# EAGLE schematic Accumulator Control Unit rev3 (EAGLE 9.6.2)

## Sheet 1 of 6: Connectors, Power Fusing, TSAL
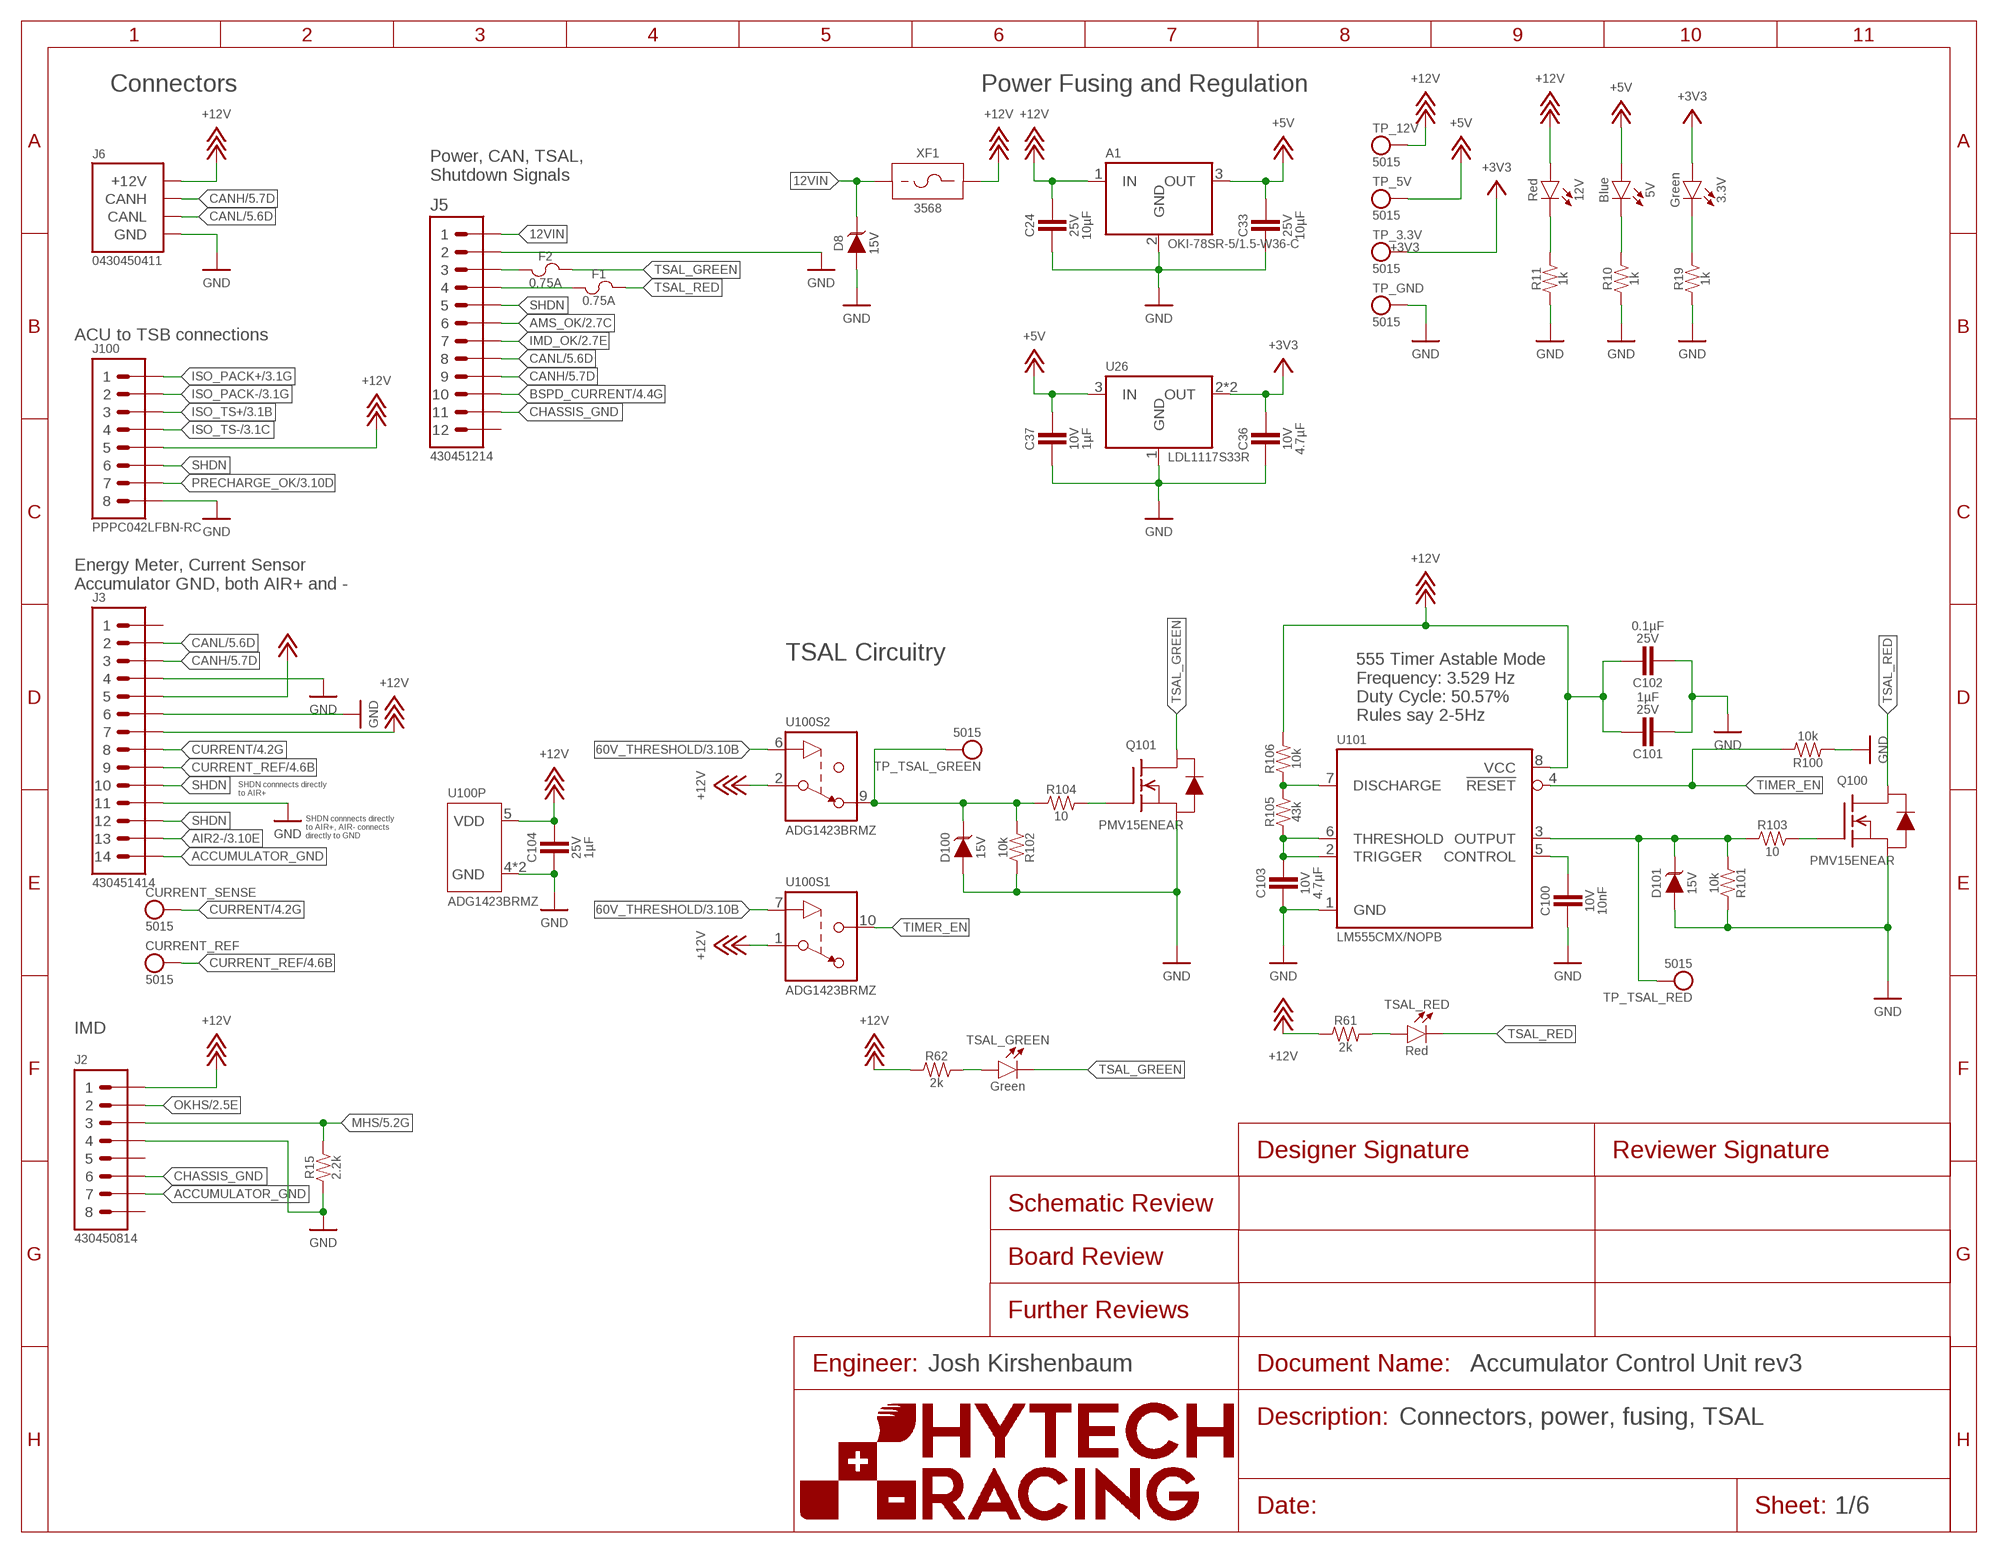
[diagram p0: schematic, sheet 1]
FRAME1 (FRAME): DESCRIPTION_1: Connectors, power, fusing, TSAL

### Parts
3.3V  LED_0603_GREEN  [0603-LED]
5V  LED_0603_BLUE  [0603-LED]
12V  LED_0603_RED  [0603-LED]
A1  VOLTAGE_REGULATOR_MODULE_OKI-78SR_5V  [OKI-78SR]
C24  CAPACITOR_0603_25V_10UF  [0603-CAP]
C33  CAPACITOR_0603_25V_10UF  [0603-CAP]
C36  CAPACITOR_0603_10V_4.7UF  [0603-CAP]
C37  CAPACITOR_0603_10V_1UF  [0603-CAP]
C100  CAPACITOR_0603_10V_10NF  [0603-CAP]
C101  CAPACITOR_0603_25V_1UF  [0603-CAP]
C102  CAPACITOR_0603_25V_0.1UF  [0603-CAP]
C103  CAPACITOR_0603_10V_4.7UF  [0603-CAP]
C104  CAPACITOR_0603_25V_1UF  [0603-CAP]
CURRENT_REF  TEST_POINT  [MICRO_MINIATURE]
CURRENT_SENSE  TEST_POINT  [MICRO_MINIATURE]
D8  TVS_15V  [SOT-23]
D100  TVS_15V  [SOT-23]
D101  TVS_15V  [SOT-23]
F1  FUSE_0603_.75A  [0603-FUSE]
F2  FUSE_0603_.75A  [0603-FUSE]
J2  CONNECTOR-8_MF_T_V_  [MOLEX_MICROFIT_PTH_VERTICAL_08_DUAL]
J3  CONNECTOR-14_MF_T_V_  [MOLEX_MICROFIT_PTH_VERTICAL_14_DUAL]
J5  CONNECTOR-12_MF_T_V_  [MOLEX_MICROFIT_PTH_VERTICAL_12_DUAL]
J6  CONNECTOR-CAN_μF_S_RA_  [MOLEX_MICROFIT_SMD_RIGHTANGLE_04_DUAL]
J100  CONNECTOR-8_S_S  [FLEX_STACK_PTH_08_DUAL]
Q100  TRANSISTOR_N_MOS__PMV15ENEA  [SOT-23]
Q101  TRANSISTOR_N_MOS__PMV15ENEA  [SOT-23]
R10  RESISTOR_0603_1K  [0603-RES]
R11  RESISTOR_0603_1K  [0603-RES]
R15  RESISTOR_0603_2.2K  [0603-RES]
R19  RESISTOR_0603_1K  [0603-RES]
R61  RESISTOR_0603_2K  [0603-RES]
R62  RESISTOR_0603_2K  [0603-RES]
R100  RESISTOR_0603_10K  [0603-RES]
R101  RESISTOR_0603_10K  [0603-RES]
R102  RESISTOR_0603_10K  [0603-RES]
R103  RESISTOR_0603_10  [0603-RES]
R104  RESISTOR_0603_10  [0603-RES]
R105  RESISTOR_0603_43K  [0603-RES]
R106  RESISTOR_0603_10K  [0603-RES]
TP_3.3V  TEST_POINT  [MICRO_MINIATURE]
TP_5V  TEST_POINT  [MICRO_MINIATURE]
TP_12V  TEST_POINT  [MICRO_MINIATURE]
TP_GND  TEST_POINT  [MICRO_MINIATURE]
TP_TSAL_GREEN  TEST_POINT  [MICRO_MINIATURE]
TP_TSAL_RED  TEST_POINT  [MICRO_MINIATURE]
TSAL_GREEN  LED_0603_GREEN  [0603-LED]
TSAL_RED  LED_0603_RED  [0603-LED]
U26  VOLTAGE_REGULATOR_SOT223_3.3V  [SOT223]
U100  ADG1423  [MSOP-10]
U101  LM555  [SOIC-08(NARROW,0.15")]
XF1  FUSE_HOLDER_MINIBLADEPTH  [3568]

### Nets
12VIN: D8.3(C) J5.1 XF1.1 XF1.2
60V_THRESHOLD: U100.6(S2:IN) U100.7(S1:IN) ; also sheet 3
+3V3: 3.3V.2(A) C36.1 TP_3.3V.1 U26.2(OUT) U26.4(OUT) ; also sheet 4,5
+5V: 5V.2(A) A1.3(OUT) C33.1 C37.1 J3.5 TP_5V.1 U26.3(IN) ; also sheet 3,5
+12V: 12V.2(A) A1.1(IN) C24.1 C101.1 C102.1 C104.1 J2.1 J3.7 J6.1(+12V) J100.5 R61.1 R62.1 R106.2 TP_12V.1 U100.1(S1:S) U100.2(S2:S) U100.5(P:VDD) U101.8(VCC) XF1.3 XF1.4 ; also sheet 2,4,5
ACCUMULATOR_GND: J2.7 J3.14
AIR2-: J3.13 ; also sheet 3
AMS_OK: J5.6 ; also sheet 2
BSPD_CURRENT: J5.10 ; also sheet 4,5
CANH: J3.3 J5.9 J6.4(CANH) ; also sheet 5
CANL: J3.2 J5.8 J6.3(CANL) ; also sheet 5
CHASSIS_GND: J2.6 J5.11
CURRENT: CURRENT_SENSE.1 J3.8 ; also sheet 4
CURRENT_REF: CURRENT_REF.1 J3.9 ; also sheet 4
GND: A1.2(GND) C24.2 C33.2 C36.2 C37.2 C100.2 C101.2 C102.2 C103.2 C104.2 D8.1(A) D100.1(A) D101.1(A) J2.4 J3.4 J3.6 J3.11 J5.2 J6.2(GND) J100.8 Q100.2(S) Q101.2(S) R10.1 R11.1 R15.1 R19.1 R100.1 R101.2 R102.2 TP_GND.1 U26.1(GND) U100.4(P:GND) U100.8(P:GND) U101.1(GND) ; also sheet 2,3,4,5
IMD_OK: J5.7 ; also sheet 2,5
ISO_PACK+: J100.1 ; also sheet 3
ISO_PACK-: J100.2 ; also sheet 3
ISO_TS+: J100.3 ; also sheet 3
ISO_TS-: J100.4 ; also sheet 3
MHS: J2.3 R15.2 ; also sheet 5
N$1: 3.3V.1(C) R19.2
N$2: 5V.1(C) R10.2
N$3: C103.1 R105.1 U101.2(TRIGGER) U101.6(THRESHOLD)
N$5: C100.1 U101.5(CONTROL)
N$6: R105.2 R106.1 U101.7(DISCHARGE)
N$14: 12V.1(C) R11.2
N$18: D100.3(C) R102.1 R104.1 TP_TSAL_GREEN.1 U100.9(S2:D)
N$19: D101.3(C) R101.1 R103.1 TP_TSAL_RED.1 U101.3(OUTPUT)
N$24: R62.2 TSAL_GREEN.2(A)
N$28: F2.1 J5.3
N$31: F1.1 J5.4
N$46: R61.2 TSAL_RED.2(A)
N$60: Q100.1(G) R103.2
N$61: Q101.1(G) R104.2
OKHS: J2.2 ; also sheet 2
PRECHARGE_OK: J100.7 ; also sheet 3,5
SHDN: J3.10 J3.12 J5.5 J100.6
TIMER_EN: R100.2 U100.10(S1:D) U101.4(!RESET)
TSAL_GREEN: F2.2 Q101.3(D) TSAL_GREEN.1(C)
TSAL_RED: F1.2 Q100.3(D) TSAL_RED.1(C)
Unconnected: J2.5 J2.8 J3.1 J5.12

### Notes on the sheet
- Connectors | Power Fusing and Regulation
- Power, CAN, TSAL, 
  Shutdown Signals
- ACU to TSB connections
- Energy Meter, Current Sensor
  Accumulator GND, both AIR+ and -
- TSAL Circuitry
- 555 Timer Astable Mode
  Frequency: 3.529 Hz
  Duty Cycle: 50.57%
  Rules say 2-5Hz
- SHDN connnects directly
  to AIR+
- SHDN connnects directly
  to AIR+, AIR- connects
  directly to GND
- IMD
- Josh Kirshenbaum

## Sheet 2 of 6: Shutdown Circuitry
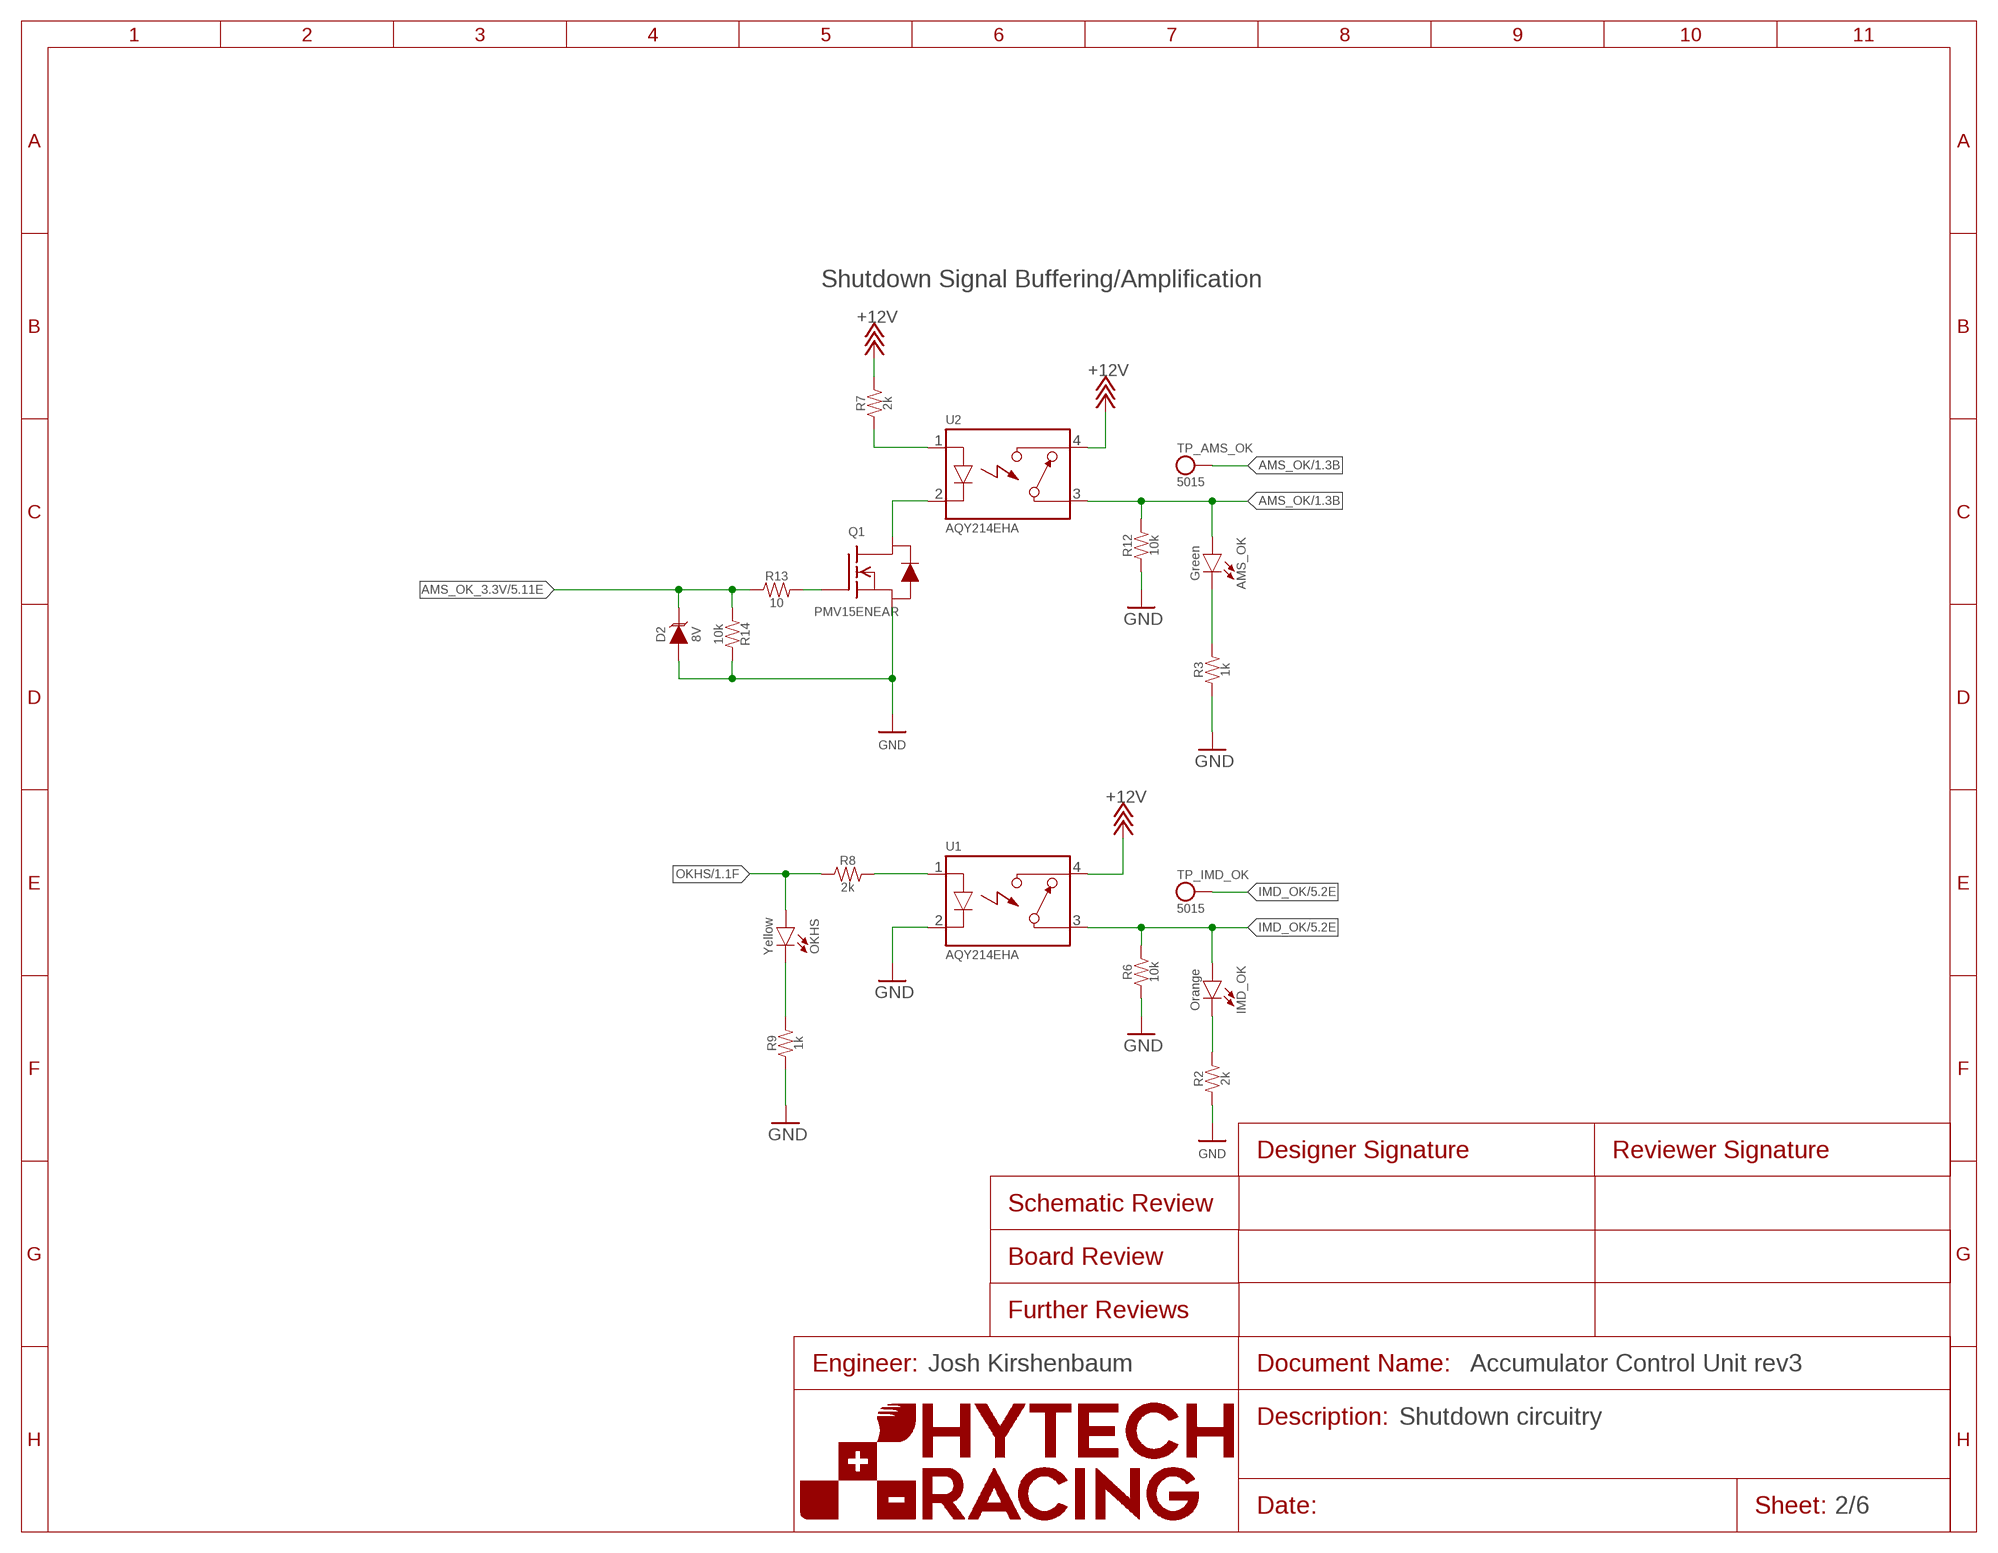
[diagram p1: schematic, sheet 2]
FRAME2 (FRAME): DESCRIPTION_1: Shutdown circuitry

### Parts
AMS_OK  LED_0603_GREEN  [0603-LED]
D2  TVS_8V  [SOT-23]
IMD_OK  LED_0603_ORANGE  [0603-LED]
OKHS  LED_0603_YELLOW  [0603-LED]
Q1  TRANSISTOR_N_MOS__PMV15ENEA  [SOT-23]
R2  RESISTOR_0603_2K  [0603-RES]
R3  RESISTOR_0603_1K  [0603-RES]
R6  RESISTOR_0603_10K  [0603-RES]
R7  RESISTOR_0603_2K  [0603-RES]
R8  RESISTOR_0603_2K  [0603-RES]
R9  RESISTOR_0603_1K  [0603-RES]
R12  RESISTOR_0603_10K  [0603-RES]
R13  RESISTOR_0603_10  [0603-RES]
R14  RESISTOR_0603_10K  [0603-RES]
TP_AMS_OK  TEST_POINT  [MICRO_MINIATURE]
TP_IMD_OK  TEST_POINT  [MICRO_MINIATURE]
U1  RELAY_SOLIDSTATE_NO  [DIP-4]
U2  RELAY_SOLIDSTATE_NO  [DIP-4]

### Nets
+12V: R7.2 U1.4(CONTACT2) U2.4(CONTACT2) ; also sheet 1,4,5
AMS_OK: AMS_OK.2(A) R12.2 TP_AMS_OK.1 U2.3(CONTACT1) ; also sheet 1
AMS_OK_3.3V: D2.3(C) R13.1 R14.1 ; also sheet 5
GND: D2.1(A) Q1.2(S) R2.1 R3.1 R6.1 R9.1 R12.1 R14.2 U1.2(CONTROL-) ; also sheet 1,3,4,5
IMD_OK: IMD_OK.2(A) R6.2 TP_IMD_OK.1 U1.3(CONTACT1) ; also sheet 1,5
N$8: R8.2 U1.1(CONTROL+)
N$9: OKHS.1(C) R9.2
N$16: R7.1 U2.1(CONTROL+)
N$17: AMS_OK.1(C) R3.2
N$20: Q1.3(D) U2.2(CONTROL-)
N$27: IMD_OK.1(C) R2.2
N$30: Q1.1(G) R13.2
OKHS: OKHS.2(A) R8.1 ; also sheet 1

### Notes on the sheet
- Shutdown Signal Buffering/Amplification
- Josh Kirshenbaum

## Sheet 3 of 6: Precharge Circuit
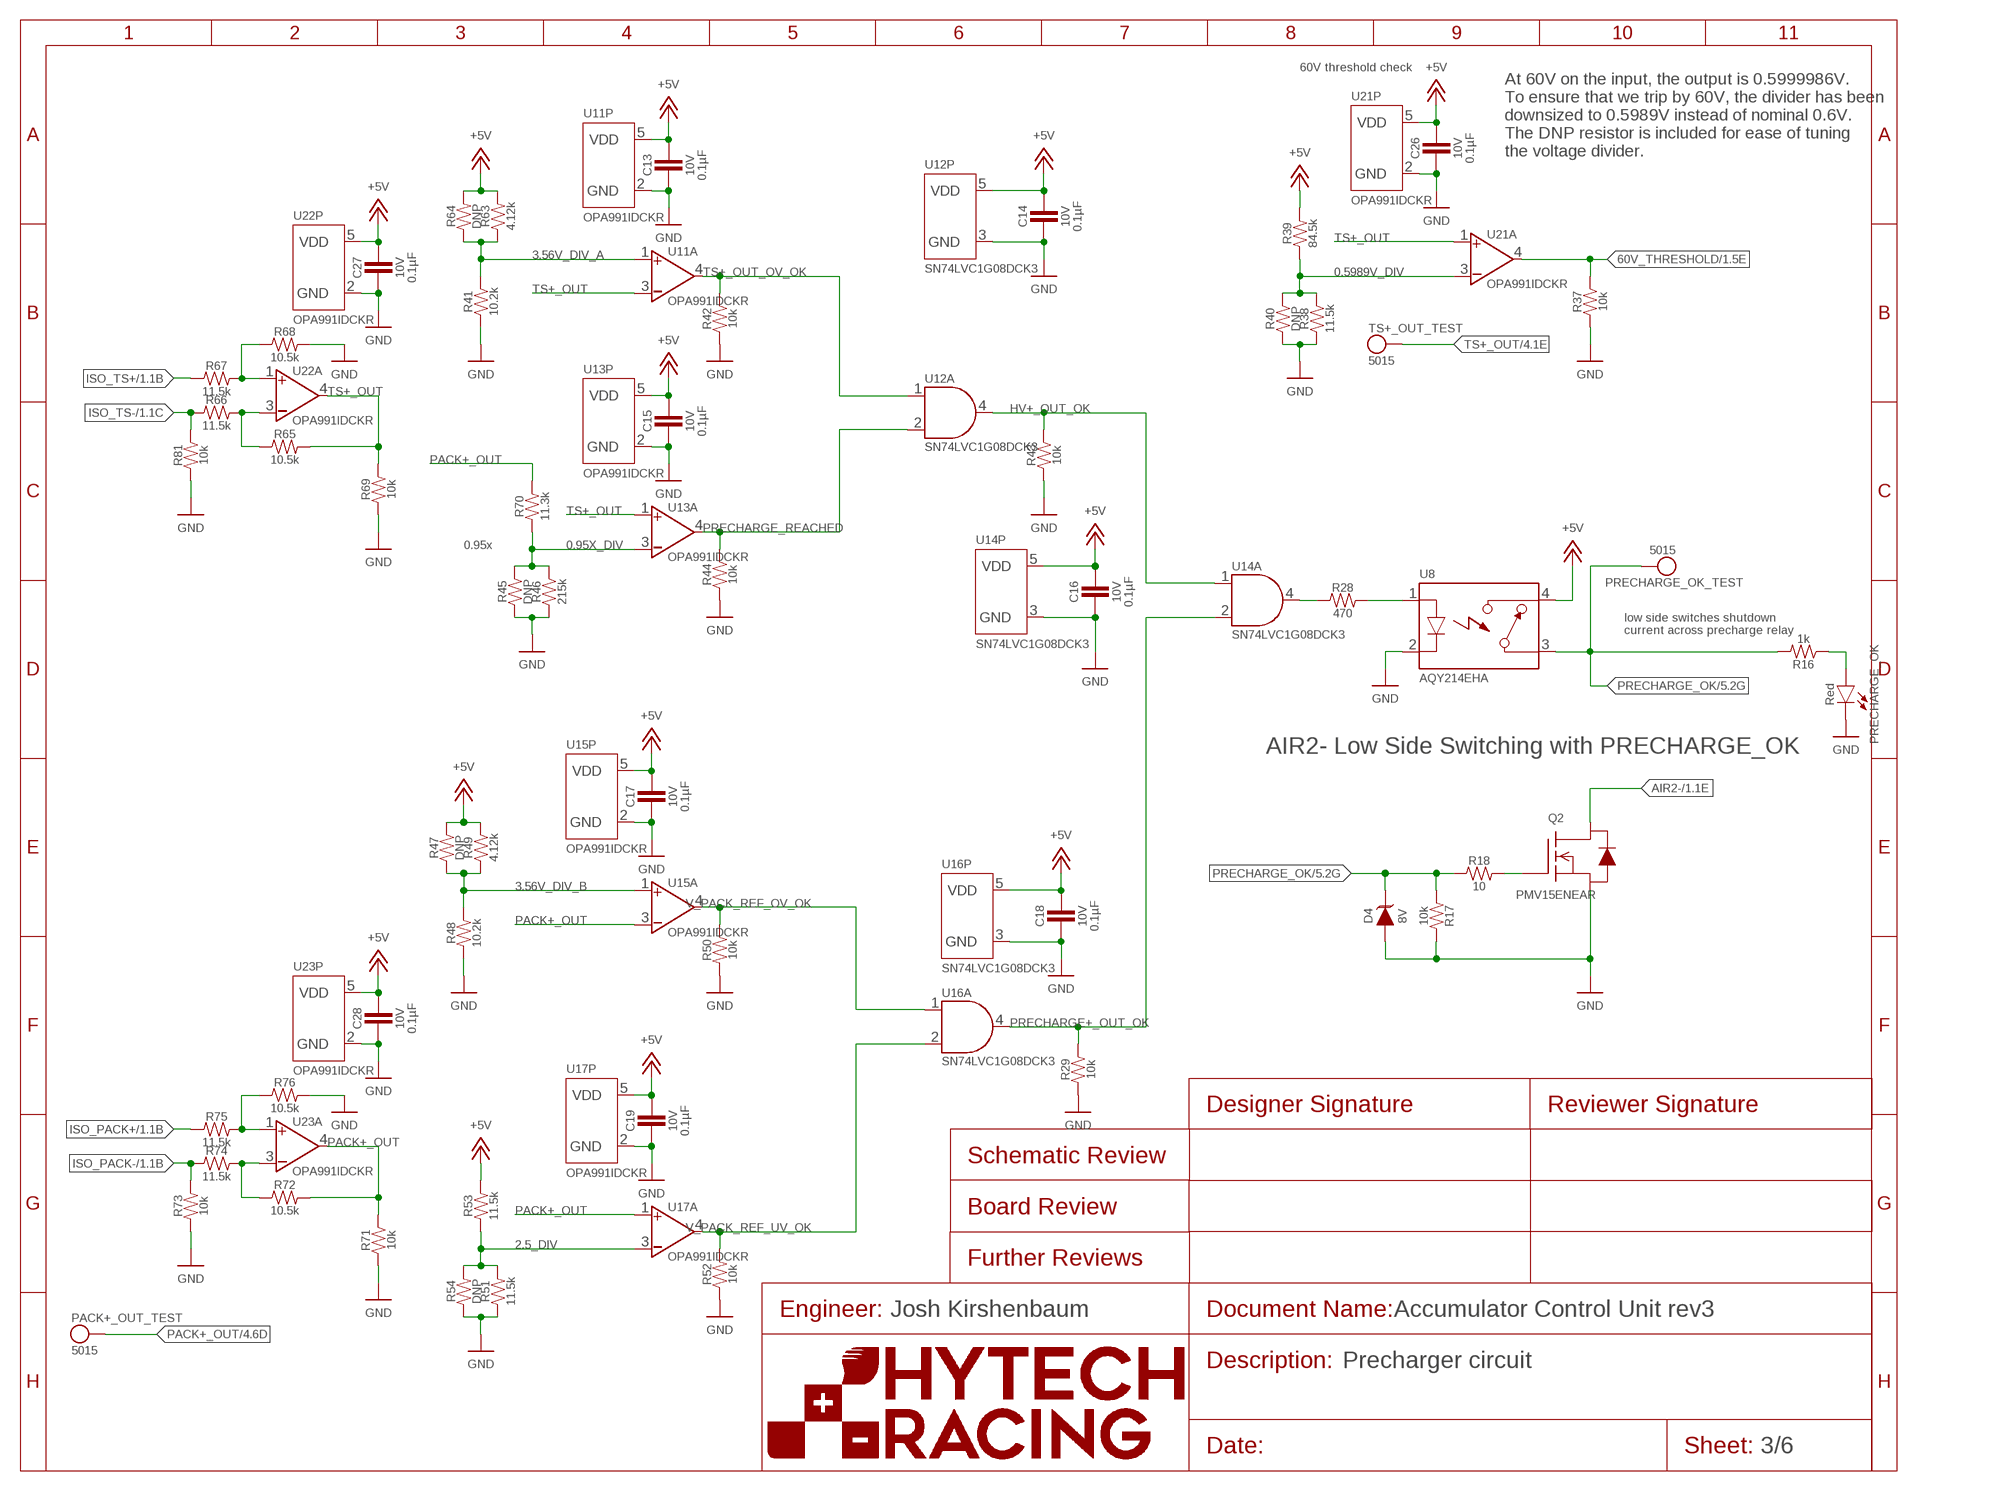
[diagram p2: schematic, sheet 3]
FRAME5 (FRAME): DESCRIPTION_1: Precharger circuit

### Parts
C13  CAPACITOR_0603_10V_0.1UF  [0603-CAP]
C14  CAPACITOR_0603_10V_0.1UF  [0603-CAP]
C15  CAPACITOR_0603_10V_0.1UF  [0603-CAP]
C16  CAPACITOR_0603_10V_0.1UF  [0603-CAP]
C17  CAPACITOR_0603_10V_0.1UF  [0603-CAP]
C18  CAPACITOR_0603_10V_0.1UF  [0603-CAP]
C19  CAPACITOR_0603_10V_0.1UF  [0603-CAP]
C26  CAPACITOR_0603_10V_0.1UF  [0603-CAP]
C27  CAPACITOR_0603_10V_0.1UF  [0603-CAP]
C28  CAPACITOR_0603_10V_0.1UF  [0603-CAP]
D4  TVS_8V  [SOT-23]
PACK+_OUT_TEST  TEST_POINT  [MICRO_MINIATURE]
PRECHARGE_OK  LED_0603_RED  [0603-LED]
PRECHARGE_OK_TEST  TEST_POINT  [MICRO_MINIATURE]
Q2  TRANSISTOR_N_MOS__PMV15ENEA  [SOT-23]
R16  RESISTOR_0603_1K  [0603-RES]
R17  RESISTOR_0603_10K  [0603-RES]
R18  RESISTOR_0603_10  [0603-RES]
R28  RESISTOR_0603_470  [0603-RES]
R29  RESISTOR_0603_10K  [0603-RES]
R37  RESISTOR_0603_10K  [0603-RES]
R38  RESISTOR_0603_11.5K  [0603-RES]
R39  RESISTOR_0603_84.5K  [0603-RES]
R40  RESISTOR_0603_DNP  [0603-RES]
R41  RESISTOR_0603_10.2K  [0603-RES]
R42  RESISTOR_0603_10K  [0603-RES]
R43  RESISTOR_0603_10K  [0603-RES]
R44  RESISTOR_0603_10K  [0603-RES]
R45  RESISTOR_0603_DNP  [0603-RES]
R46  RESISTOR_0603_215K  [0603-RES]
R47  RESISTOR_0603_DNP  [0603-RES]
R48  RESISTOR_0603_10.2K  [0603-RES]
R49  RESISTOR_0603_4.12K  [0603-RES]
R50  RESISTOR_0603_10K  [0603-RES]
R51  RESISTOR_0603_11.5K  [0603-RES]
R52  RESISTOR_0603_10K  [0603-RES]
R53  RESISTOR_0603_11.5K  [0603-RES]
R54  RESISTOR_0603_DNP  [0603-RES]
R63  RESISTOR_0603_4.12K  [0603-RES]
R64  RESISTOR_0603_DNP  [0603-RES]
R65  RESISTOR_0603_10.5K  [0603-RES]
R66  RESISTOR_0603_11.5K  [0603-RES]
R67  RESISTOR_0603_11.5K  [0603-RES]
R68  RESISTOR_0603_10.5K  [0603-RES]
R69  RESISTOR_0603_10K  [0603-RES]
R70  RESISTOR_0603_11.3K  [0603-RES]
R71  RESISTOR_0603_10K  [0603-RES]
R72  RESISTOR_0603_10.5K  [0603-RES]
R73  RESISTOR_0603_10K  [0603-RES]
R74  RESISTOR_0603_11.5K  [0603-RES]
R75  RESISTOR_0603_11.5K  [0603-RES]
R76  RESISTOR_0603_10.5K  [0603-RES]
R81  RESISTOR_0603_10K  [0603-RES]
TS+_OUT_TEST  TEST_POINT  [MICRO_MINIATURE]
U8  RELAY_SOLIDSTATE_NO  [DIP-4]
U11  OPAMP_1_CHANNEL_OPA991  [SC-70-5]
U12  LOGICGATE_AND_DCK3  [SC-70-5]
U13  OPAMP_1_CHANNEL_OPA991  [SC-70-5]
U14  LOGICGATE_AND_DCK3  [SC-70-5]
U15  OPAMP_1_CHANNEL_OPA991  [SC-70-5]
U16  LOGICGATE_AND_DCK3  [SC-70-5]
U17  OPAMP_1_CHANNEL_OPA991  [SC-70-5]
U21  OPAMP_1_CHANNEL_OPA991  [SC-70-5]
U22  OPAMP_1_CHANNEL_OPA991  [SC-70-5]
U23  OPAMP_1_CHANNEL_OPA991  [SC-70-5]

### Nets
0.95X_DIV: R45.2 R46.2 R70.1 U13.3(A:VIN-)
0.5989V_DIV: R38.2 R39.1 R40.2 U21.3(A:VIN-)
2.5_DIV: R51.2 R53.1 R54.2 U17.3(A:VIN-)
3.56V_DIV_A: R41.2 R63.1 R64.1 U11.1(A:VIN+)
3.56V_DIV_B: R47.1 R48.2 R49.1 U15.1(A:VIN+)
60V_THRESHOLD: R37.2 U21.4(A:VOUT) ; also sheet 1
+5V: C13.1 C14.1 C15.1 C16.1 C17.1 C18.1 C19.1 C26.1 C27.1 C28.1 R39.2 R47.2 R49.2 R53.2 R63.2 R64.2 U8.4(CONTACT2) U11.5(P:VDD) U12.5(P:VDD) U13.5(P:VDD) U14.5(P:VDD) U15.5(P:VDD) U16.5(P:VDD) U17.5(P:VDD) U21.5(P:VDD) U22.5(P:VDD) U23.5(P:VDD) ; also sheet 1,5
AIR2-: Q2.3(D) ; also sheet 1
GND: C13.2 C14.2 C15.2 C16.2 C17.2 C18.2 C19.2 C26.2 C27.2 C28.2 D4.1(A) PRECHARGE_OK.1(C) Q2.2(S) R17.2 R29.1 R37.1 R38.1 R40.1 R41.1 R42.1 R43.1 R44.1 R45.1 R46.1 R48.1 R50.1 R51.1 R52.1 R54.1 R68.2 R69.1 R71.1 R73.1 R76.2 R81.1 U8.2(CONTROL-) U11.2(P:GND) U12.3(P:GND) U13.2(P:GND) U14.3(P:GND) U15.2(P:GND) U16.3(P:GND) U17.2(P:GND) U21.2(P:GND) U22.2(P:GND) U23.2(P:GND) ; also sheet 1,2,4,5
HV+_OUT_OK: R43.2 U12.4(A:OUT) U14.1(A:IN1)
ISO_PACK+: R75.1 ; also sheet 1
ISO_PACK-: R73.2 R74.1 ; also sheet 1
ISO_TS+: R67.1 ; also sheet 1
ISO_TS-: R66.1 R81.2 ; also sheet 1
N$4: PRECHARGE_OK.2(A) R16.1
N$7: Q2.1(G) R18.2
N$10: R67.2 R68.1 U22.1(A:VIN+)
N$11: R65.1 R66.2 U22.3(A:VIN-)
N$22: R75.2 R76.1 U23.1(A:VIN+)
N$23: R72.1 R74.2 U23.3(A:VIN-)
N$41: R28.1 U14.4(A:OUT)
N$49: R28.2 U8.1(CONTROL+)
PACK+_OUT: PACK+_OUT_TEST.1 R70.2 R71.2 R72.2 U15.3(A:VIN-) U17.1(A:VIN+) U23.4(A:VOUT) ; also sheet 4
PRECHARGE+_OUT_OK: R29.2 U14.2(A:IN2) U16.4(A:OUT)
PRECHARGE_OK: D4.3(C) PRECHARGE_OK_TEST.1 R16.2 R17.1 R18.1 U8.3(CONTACT1) ; also sheet 1,5
PRECHARGE_REACHED: R44.2 U12.2(A:IN2) U13.4(A:VOUT)
TS+_OUT: R65.2 R69.2 TS+_OUT_TEST.1 U11.3(A:VIN-) U13.1(A:VIN+) U21.1(A:VIN+) U22.4(A:VOUT) ; also sheet 4
TS+_OUT_OV_OK: R42.2 U11.4(A:VOUT) U12.1(A:IN1)
V_PACK_REF_OV_OK: R50.2 U15.4(A:VOUT) U16.1(A:IN1)
V_PACK_REF_UV_OK: R52.2 U16.2(A:IN2) U17.4(A:VOUT)

### Notes on the sheet
- 60V threshold check
- At 60V on the input, the output is 0.5999986V.
  To ensure that we trip by 60V, the divider has been
  downsized to 0.5989V instead of nominal 0.6V.
  The DNP resistor is included for ease of tuning
  the voltage divider.
- 0.95x
- low side switches shutdown 
  current across precharge relay
- AIR2- Low Side Switching with PRECHARGE_OK
- Josh Kirshenbaum

## Sheet 4 of 6: Analog Filtering
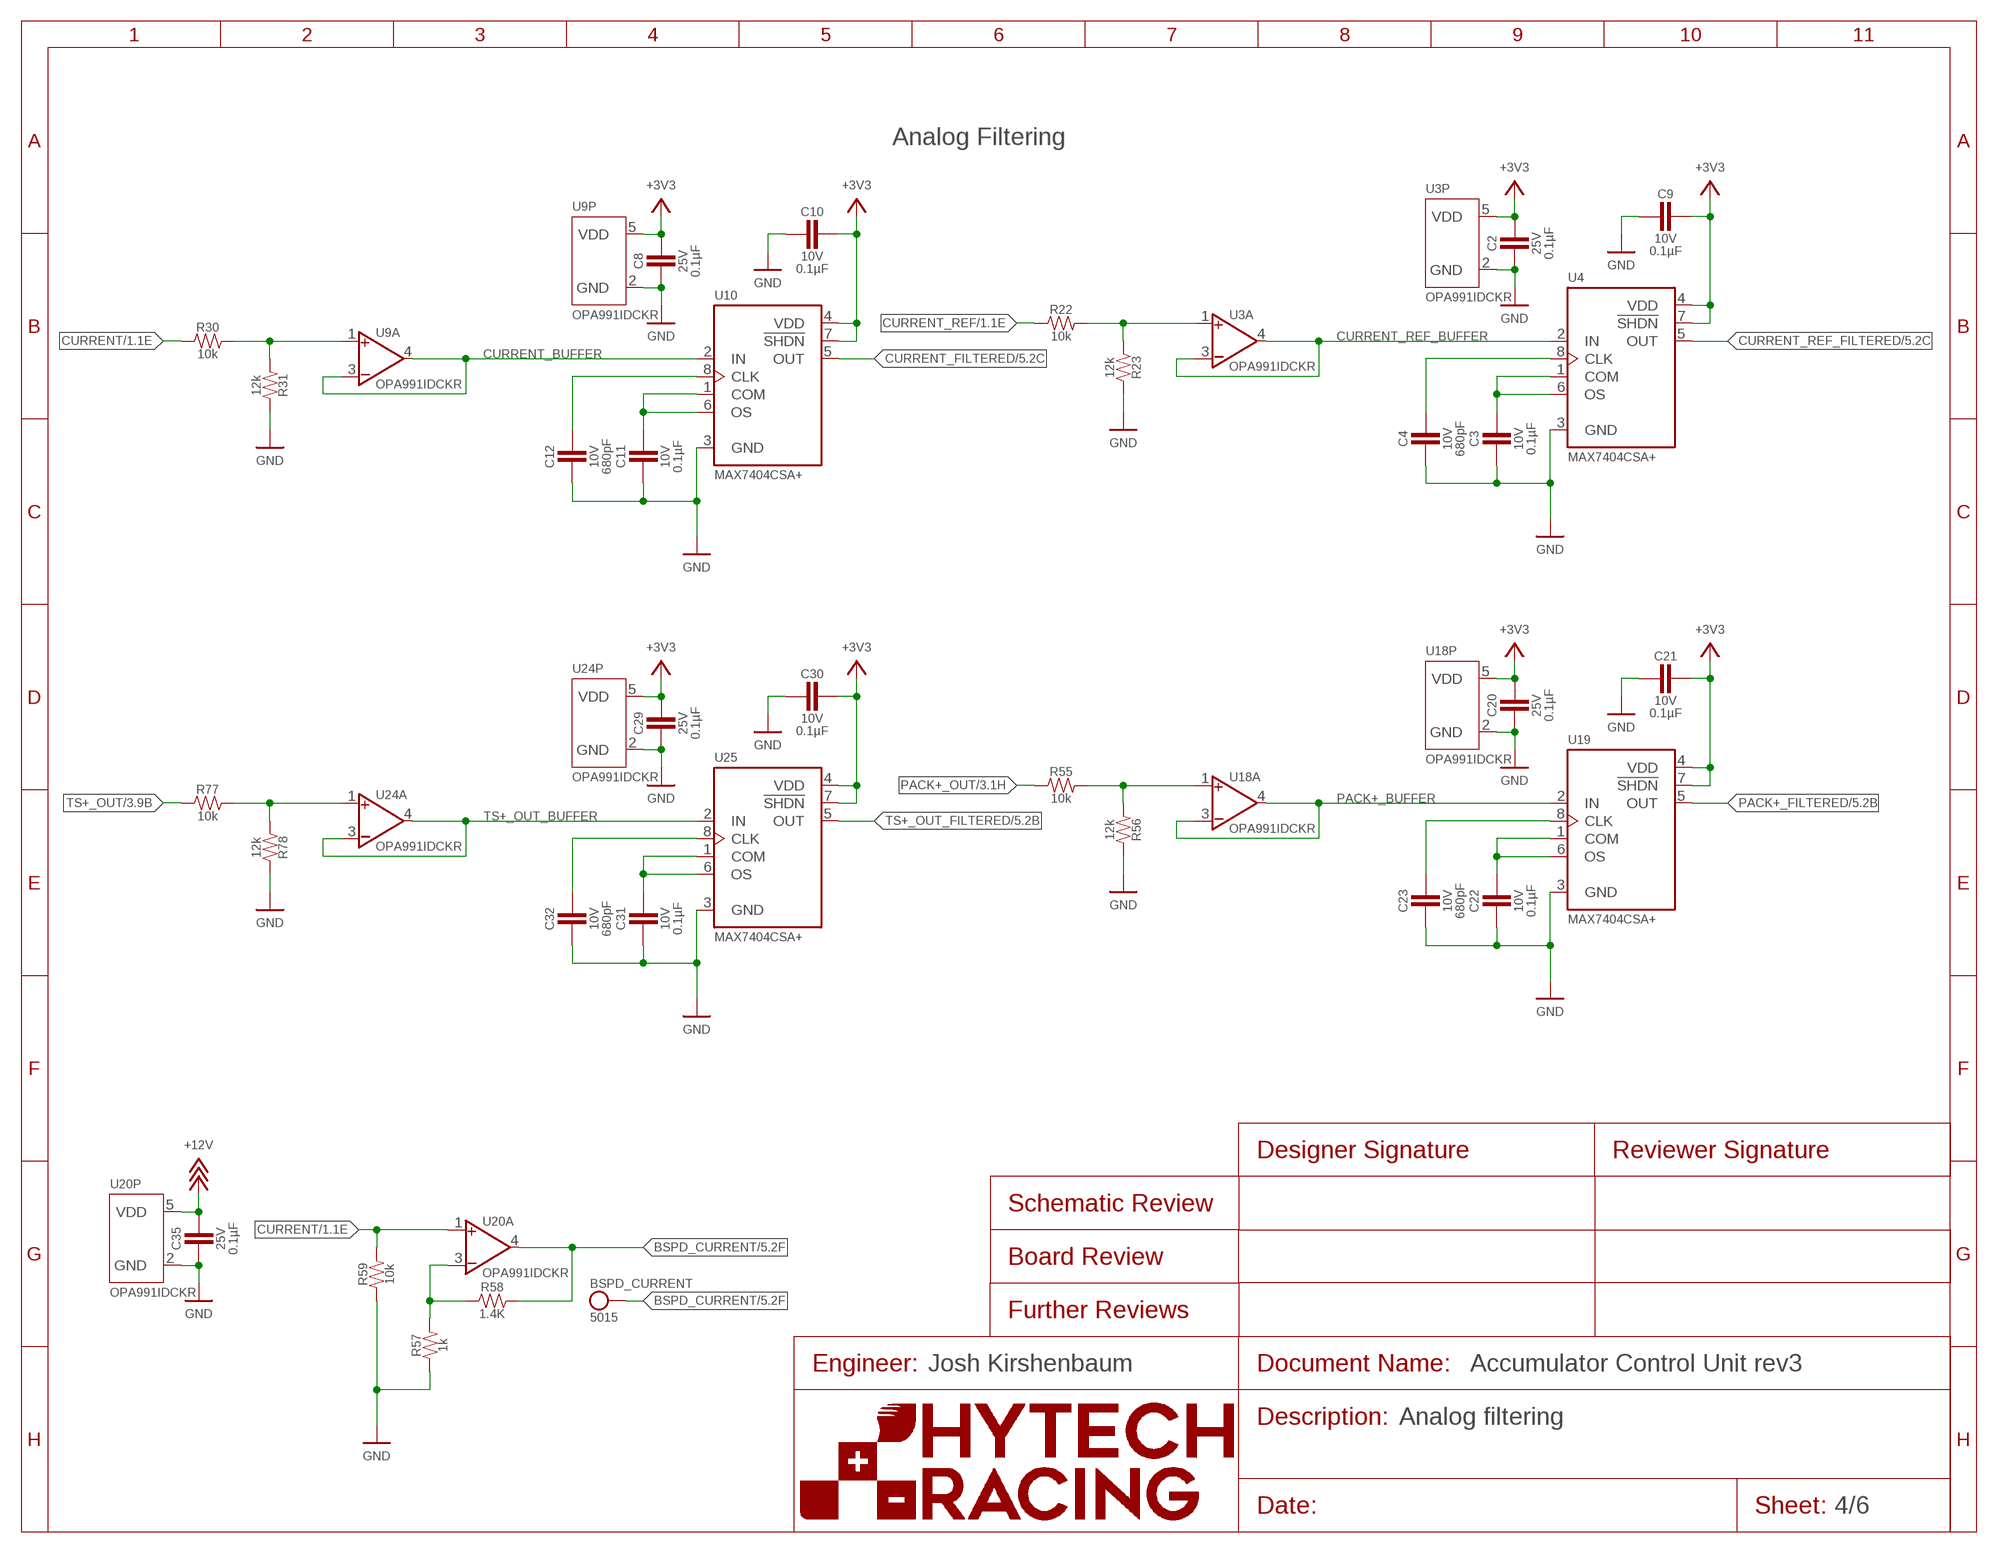
[diagram p3: schematic, sheet 4]
FRAME4 (FRAME): DESCRIPTION_1: Analog filtering

### Parts
BSPD_CURRENT  TEST_POINT  [MICRO_MINIATURE]
C2  CAPACITOR_0603_25V_0.1UF  [0603-CAP]
C3  CAPACITOR_0603_10V_0.1UF  [0603-CAP]
C4  CAPACITOR_0603_10V_680PF  [0603-CAP]
C8  CAPACITOR_0603_25V_0.1UF  [0603-CAP]
C9  CAPACITOR_0603_10V_0.1UF  [0603-CAP]
C10  CAPACITOR_0603_10V_0.1UF  [0603-CAP]
C11  CAPACITOR_0603_10V_0.1UF  [0603-CAP]
C12  CAPACITOR_0603_10V_680PF  [0603-CAP]
C20  CAPACITOR_0603_25V_0.1UF  [0603-CAP]
C21  CAPACITOR_0603_10V_0.1UF  [0603-CAP]
C22  CAPACITOR_0603_10V_0.1UF  [0603-CAP]
C23  CAPACITOR_0603_10V_680PF  [0603-CAP]
C29  CAPACITOR_0603_25V_0.1UF  [0603-CAP]
C30  CAPACITOR_0603_10V_0.1UF  [0603-CAP]
C31  CAPACITOR_0603_10V_0.1UF  [0603-CAP]
C32  CAPACITOR_0603_10V_680PF  [0603-CAP]
C35  CAPACITOR_0603_25V_0.1UF  [0603-CAP]
R22  RESISTOR_0603_10K  [0603-RES]
R23  RESISTOR_0603_12K  [0603-RES]
R30  RESISTOR_0603_10K  [0603-RES]
R31  RESISTOR_0603_12K  [0603-RES]
R55  RESISTOR_0603_10K  [0603-RES]
R56  RESISTOR_0603_12K  [0603-RES]
R57  RESISTOR_0603_1K  [0603-RES]
R58  RESISTOR_0603_1.4K  [0603-RES]
R59  RESISTOR_0603_10K  [0603-RES]
R77  RESISTOR_0603_10K  [0603-RES]
R78  RESISTOR_0603_12K  [0603-RES]
U3  OPAMP_1_CHANNEL_OPA991  [SC-70-5]
U4  MAX7404  [SOIC-08(NARROW,0.15")]
U9  OPAMP_1_CHANNEL_OPA991  [SC-70-5]
U10  MAX7404  [SOIC-08(NARROW,0.15")]
U18  OPAMP_1_CHANNEL_OPA991  [SC-70-5]
U19  MAX7404  [SOIC-08(NARROW,0.15")]
U20  OPAMP_1_CHANNEL_OPA991  [SC-70-5]
U24  OPAMP_1_CHANNEL_OPA991  [SC-70-5]
U25  MAX7404  [SOIC-08(NARROW,0.15")]

### Nets
+3V3: C2.1 C8.1 C9.1 C10.1 C20.1 C21.1 C29.1 C30.1 U3.5(P:VDD) U4.4(VDD) U4.7(!SHDN) U9.5(P:VDD) U10.4(VDD) U10.7(!SHDN) U18.5(P:VDD) U19.4(VDD) U19.7(!SHDN) U24.5(P:VDD) U25.4(VDD) U25.7(!SHDN) ; also sheet 1,5
+12V: C35.1 U20.5(P:VDD) ; also sheet 1,2,5
BSPD_CURRENT: BSPD_CURRENT.1 R58.2 U20.4(A:VOUT) ; also sheet 1,5
CURRENT: R30.1 R59.2 U20.1(A:VIN+) ; also sheet 1
CURRENT_BUFFER: U9.3(A:VIN-) U9.4(A:VOUT) U10.2(IN)
CURRENT_FILTERED: U10.5(OUT) ; also sheet 5
CURRENT_REF: R22.1 ; also sheet 1
CURRENT_REF_BUFFER: U3.3(A:VIN-) U3.4(A:VOUT) U4.2(IN)
CURRENT_REF_FILTERED: U4.5(OUT) ; also sheet 5
GND: C2.2 C3.2 C4.2 C8.2 C9.2 C10.2 C11.2 C12.2 C20.2 C21.2 C22.2 C23.2 C29.2 C30.2 C31.2 C32.2 C35.2 R23.2 R31.2 R56.2 R57.1 R59.1 R78.2 U3.2(P:GND) U4.3(GND) U9.2(P:GND) U10.3(GND) U18.2(P:GND) U19.3(GND) U20.2(P:GND) U24.2(P:GND) U25.3(GND) ; also sheet 1,2,3,5
N$12: R57.2 R58.1 U20.3(A:VIN-)
N$26: C31.1 U25.1(COM) U25.6(OS)
N$45: C32.1 U25.8(CLK)
N$48: R77.2 R78.1 U24.1(A:VIN+)
N$50: C11.1 U10.1(COM) U10.6(OS)
N$51: C12.1 U10.8(CLK)
N$52: R30.2 R31.1 U9.1(A:VIN+)
N$53: C3.1 U4.1(COM) U4.6(OS)
N$54: C4.1 U4.8(CLK)
N$55: R22.2 R23.1 U3.1(A:VIN+)
N$56: C22.1 U19.1(COM) U19.6(OS)
N$57: C23.1 U19.8(CLK)
N$58: R55.2 R56.1 U18.1(A:VIN+)
PACK+_BUFFER: U18.3(A:VIN-) U18.4(A:VOUT) U19.2(IN)
PACK+_FILTERED: U19.5(OUT) ; also sheet 5
PACK+_OUT: R55.1 ; also sheet 3
TS+_OUT: R77.1 ; also sheet 3
TS+_OUT_BUFFER: U24.3(A:VIN-) U24.4(A:VOUT) U25.2(IN)
TS+_OUT_FILTERED: U25.5(OUT) ; also sheet 5

### Notes on the sheet
- Analog Filtering
- Josh Kirshenbaum

## Sheet 5 of 6: Teensy, LTC6820, CAN, Watchdog
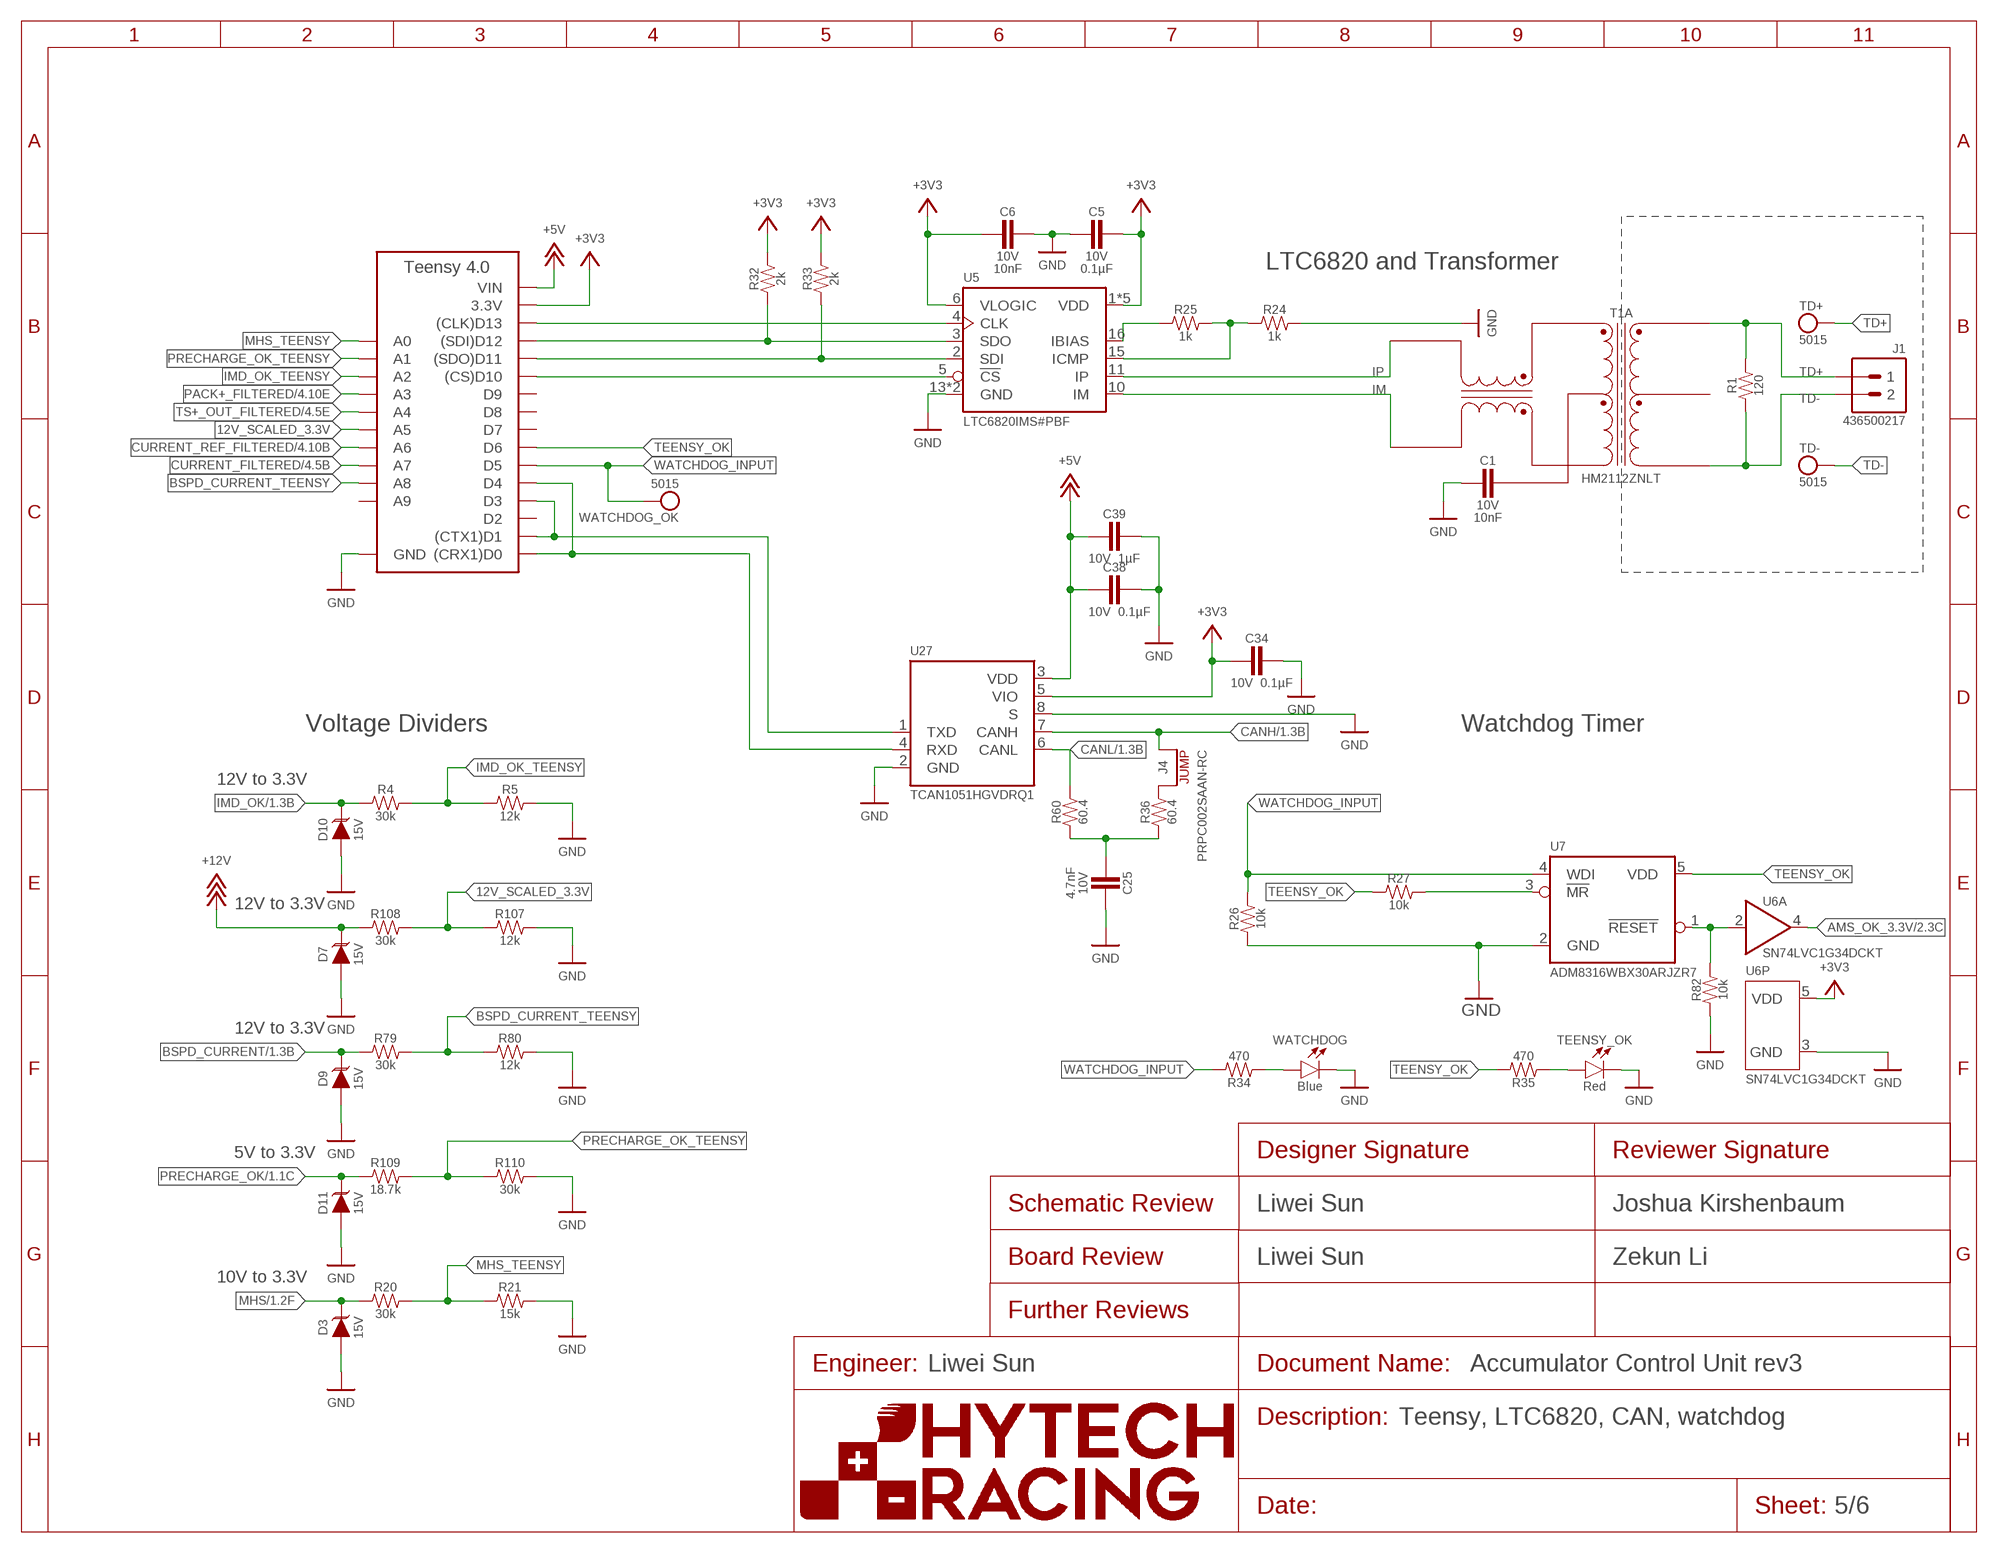
[diagram p4: schematic, sheet 5]
FRAME3 (FRAME): DESCRIPTION_1: Teensy, LTC6820, CAN, watchdog; DESIGNER_BOARD: Liwei Sun; DESIGNER_SCHEMATIC: Liwei Sun; ENGINEER: Liwei Sun; REVIEWER_BOARD: Zekun Li; REVIEWER_SCHEMATIC: Joshua Kirshenbaum

### Parts
A2  TEENSY_4.0  [TEENSY_SHORT]
C1  CAPACITOR_0603_10V_10NF  [0603-CAP]
C5  CAPACITOR_0603_10V_0.1UF  [0603-CAP]
C6  CAPACITOR_0603_10V_10NF  [0603-CAP]
C25  CAPACITOR_0603_10V_4.7NF  [0603-CAP]
C34  CAPACITOR_0603_10V_0.1UF  [0603-CAP]
C38  CAPACITOR_0603_10V_0.1UF  [0603-CAP]
C39  CAPACITOR_0603_10V_1UF  [0603-CAP]
D3  TVS_15V  [SOT-23]
D7  TVS_15V  [SOT-23]
D9  TVS_15V  [SOT-23]
D10  TVS_15V  [SOT-23]
D11  TVS_15V  [SOT-23]
J1  CONNECTOR-2_MF_T_V_  [MOLEX_MICROFIT_PTH_VERTICAL_02_SINGLE]
J4  JUMPER__1X02  [1X02]
R1  RESISTOR_0603_120  [0603-RES]
R4  RESISTOR_0603_  RESISTOR_0603_30K  [0603-RES]
R5  RESISTOR_0603_12K  [0603-RES]
R20  RESISTOR_0603_  RESISTOR_0603_30K  [0603-RES]
R21  RESISTOR_0603_15K  [0603-RES]
R24  RESISTOR_0603_1K  [0603-RES]
R25  RESISTOR_0603_1K  [0603-RES]
R26  RESISTOR_0603_10K  [0603-RES]
R27  RESISTOR_0603_10K  [0603-RES]
R32  RESISTOR_0603_2K  [0603-RES]
R33  RESISTOR_0603_2K  [0603-RES]
R34  RESISTOR_0603_470  [0603-RES]
R35  RESISTOR_0603_470  [0603-RES]
R36  RESISTOR_0603_60.4  [0603-RES]
R60  RESISTOR_0603_60.4  [0603-RES]
R79  RESISTOR_0603_  RESISTOR_0603_30K  [0603-RES]
R80  RESISTOR_0603_12K  [0603-RES]
R82  RESISTOR_0603_10K  [0603-RES]
R107  RESISTOR_0603_12K  [0603-RES]
R108  RESISTOR_0603_  RESISTOR_0603_30K  [0603-RES]
R109  RESISTOR_0603_18.7K  [0603-RES]
R110  RESISTOR_0603_  RESISTOR_0603_30K  [0603-RES]
T1  TRANSFORMER_HM2112ZNLT_AIRGAP  [HM2112ZNLT_AIRGAP]
TD+  TEST_POINT  [MICRO_MINIATURE]
TD-  TEST_POINT  [MICRO_MINIATURE]
TEENSY_OK  LED_0603_RED  [0603-LED]
U5  LTC6820  [MSOP-16]
U6  LOGICGATE_BUFFER  [SC-70-5]
U7  ADM8316WBX30  [SOT-23-5]
U27  TCAN1051HQV-Q1  [SOIC-08(NARROW,0.15")]
WATCHDOG  LED_0603_BLUE  [0603-LED]
WATCHDOG_OK  TEST_POINT  [MICRO_MINIATURE]

### Nets
12V_SCALED_3.3V: A2.D19(A5) R107.1 R108.2
+3V3: A2.3.3V C5.1 C6.2 C34.2 R32.2 R33.2 U5.1(VDD) U5.6(VLOGIC) U5.7(VDD) U5.8(VDD) U5.9(VDD) U5.12(VDD) U6.5(P:VDD) U27.5(VIO) ; also sheet 1,4
+5V: A2.VIN C38.2 C39.2 U27.3(VDD) ; also sheet 1,3
+12V: D7.3(C) R108.1 ; also sheet 1,2,4
AMS_OK_3.3V: U6.4(A:OUT) ; also sheet 2
BSPD_CURRENT: D9.3(C) R79.1 ; also sheet 1,4
BSPD_CURRENT_TEENSY: A2.D22(A8) R79.2 R80.1
CANH: J4.1 U27.7(CANH) ; also sheet 1
CANH/1.3B: J4.2 R36.2
CANL: R60.2 U27.6(CANL) ; also sheet 1
CS_LTC_6820: A2.D10((CS)D10) U5.5(!CS)
CURRENT_FILTERED: A2.D21(A7) ; also sheet 4
CURRENT_REF_FILTERED: A2.D20(A6) ; also sheet 4
GND: A2.AGND/GND(GND) A2.GND C1.2 C5.2 C6.1 C25.1 C34.1 C38.1 C39.1 D3.1(A) D7.1(A) D9.1(A) D10.1(A) D11.1(A) R5.2 R21.2 R24.2 R26.1 R80.2 R82.1 R107.2 R110.2 TEENSY_OK.1(C) U5.13(GND) U5.14(GND) U6.3(P:GND) U7.2(GND) U27.2(GND) U27.8(S) WATCHDOG.1(C) ; also sheet 1,2,3,4
IM: T1.10(A:TD-) U5.10(IM)
IMD_OK: D10.3(C) R4.1 ; also sheet 1,2
IMD_OK_TEENSY: A2.D16(A2) R4.2 R5.1
IP: T1.12(A:TD+) U5.11(IP)
MHS: D3.3(C) R20.1 ; also sheet 1
MHS_TEENSY: A2.D14(A0) R20.2 R21.1
N$13: A2.D11((SDO)D11) R33.1 U5.2(SDI)
N$15: R82.2 U6.2(A:IN) U7.1(!RESET!)
N$21: C25.2 R36.1 R60.1
N$25: A2.D0((CRX1)D0) A2.D4 U27.4(RXD)
N$29: A2.D1((CTX1)D1) A2.D3 U27.1(TXD)
N$36: R25.1 U5.16(IBIAS)
N$37: R24.1 R25.2 U5.15(ICMP)
N$39: C1.1 T1.11(A:TCT)
N$43: A2.D12((SDI)D12) R32.1 U5.3(SDO)
N$44: A2.D13((CLK)D13) U5.4(CLK)
N$47: R34.1 WATCHDOG.2(A)
N$59: R35.1 TEENSY_OK.2(A)
N$95: R27.2 U7.3(!MR!)
PACK+_FILTERED: A2.D17(A3) ; also sheet 4
PRECHARGE_OK: D11.3(C) R109.1 ; also sheet 1,3
PRECHARGE_OK_TEENSY: A2.D15(A1) R109.2 R110.1
TD+: J1.1 R1.2 T1.1(A:MX+) TD+.1
TD-: J1.2 R1.1 T1.3(A:MX-) TD-.1
TEENSY_OK: A2.D6 R27.1 R35.2 U7.5(VDD)
TS+_OUT_FILTERED: A2.D18(A4) ; also sheet 4
WATCHDOG_INPUT: A2.D5 R26.2 R34.2 U7.4(WDI) WATCHDOG_OK.1
Unconnected: A2.D2 A2.D7 A2.D8 A2.D9 A2.D23(A9) T1.2(A:MCT) T1.4(B:MX+) T1.5(B:MCT) T1.6(B:MX-) T1.7(B:TD-) T1.8(B:TCT) T1.9(B:TD+)

### Notes on the sheet
- LTC6820 and Transformer
- Voltage Dividers | Watchdog Timer
- 12V to 3.3V
- 12V to 3.3V
- 12V to 3.3V
- 5V to 3.3V
- 10V to 3.3V

## Sheet 6 of 6: Ordering Components
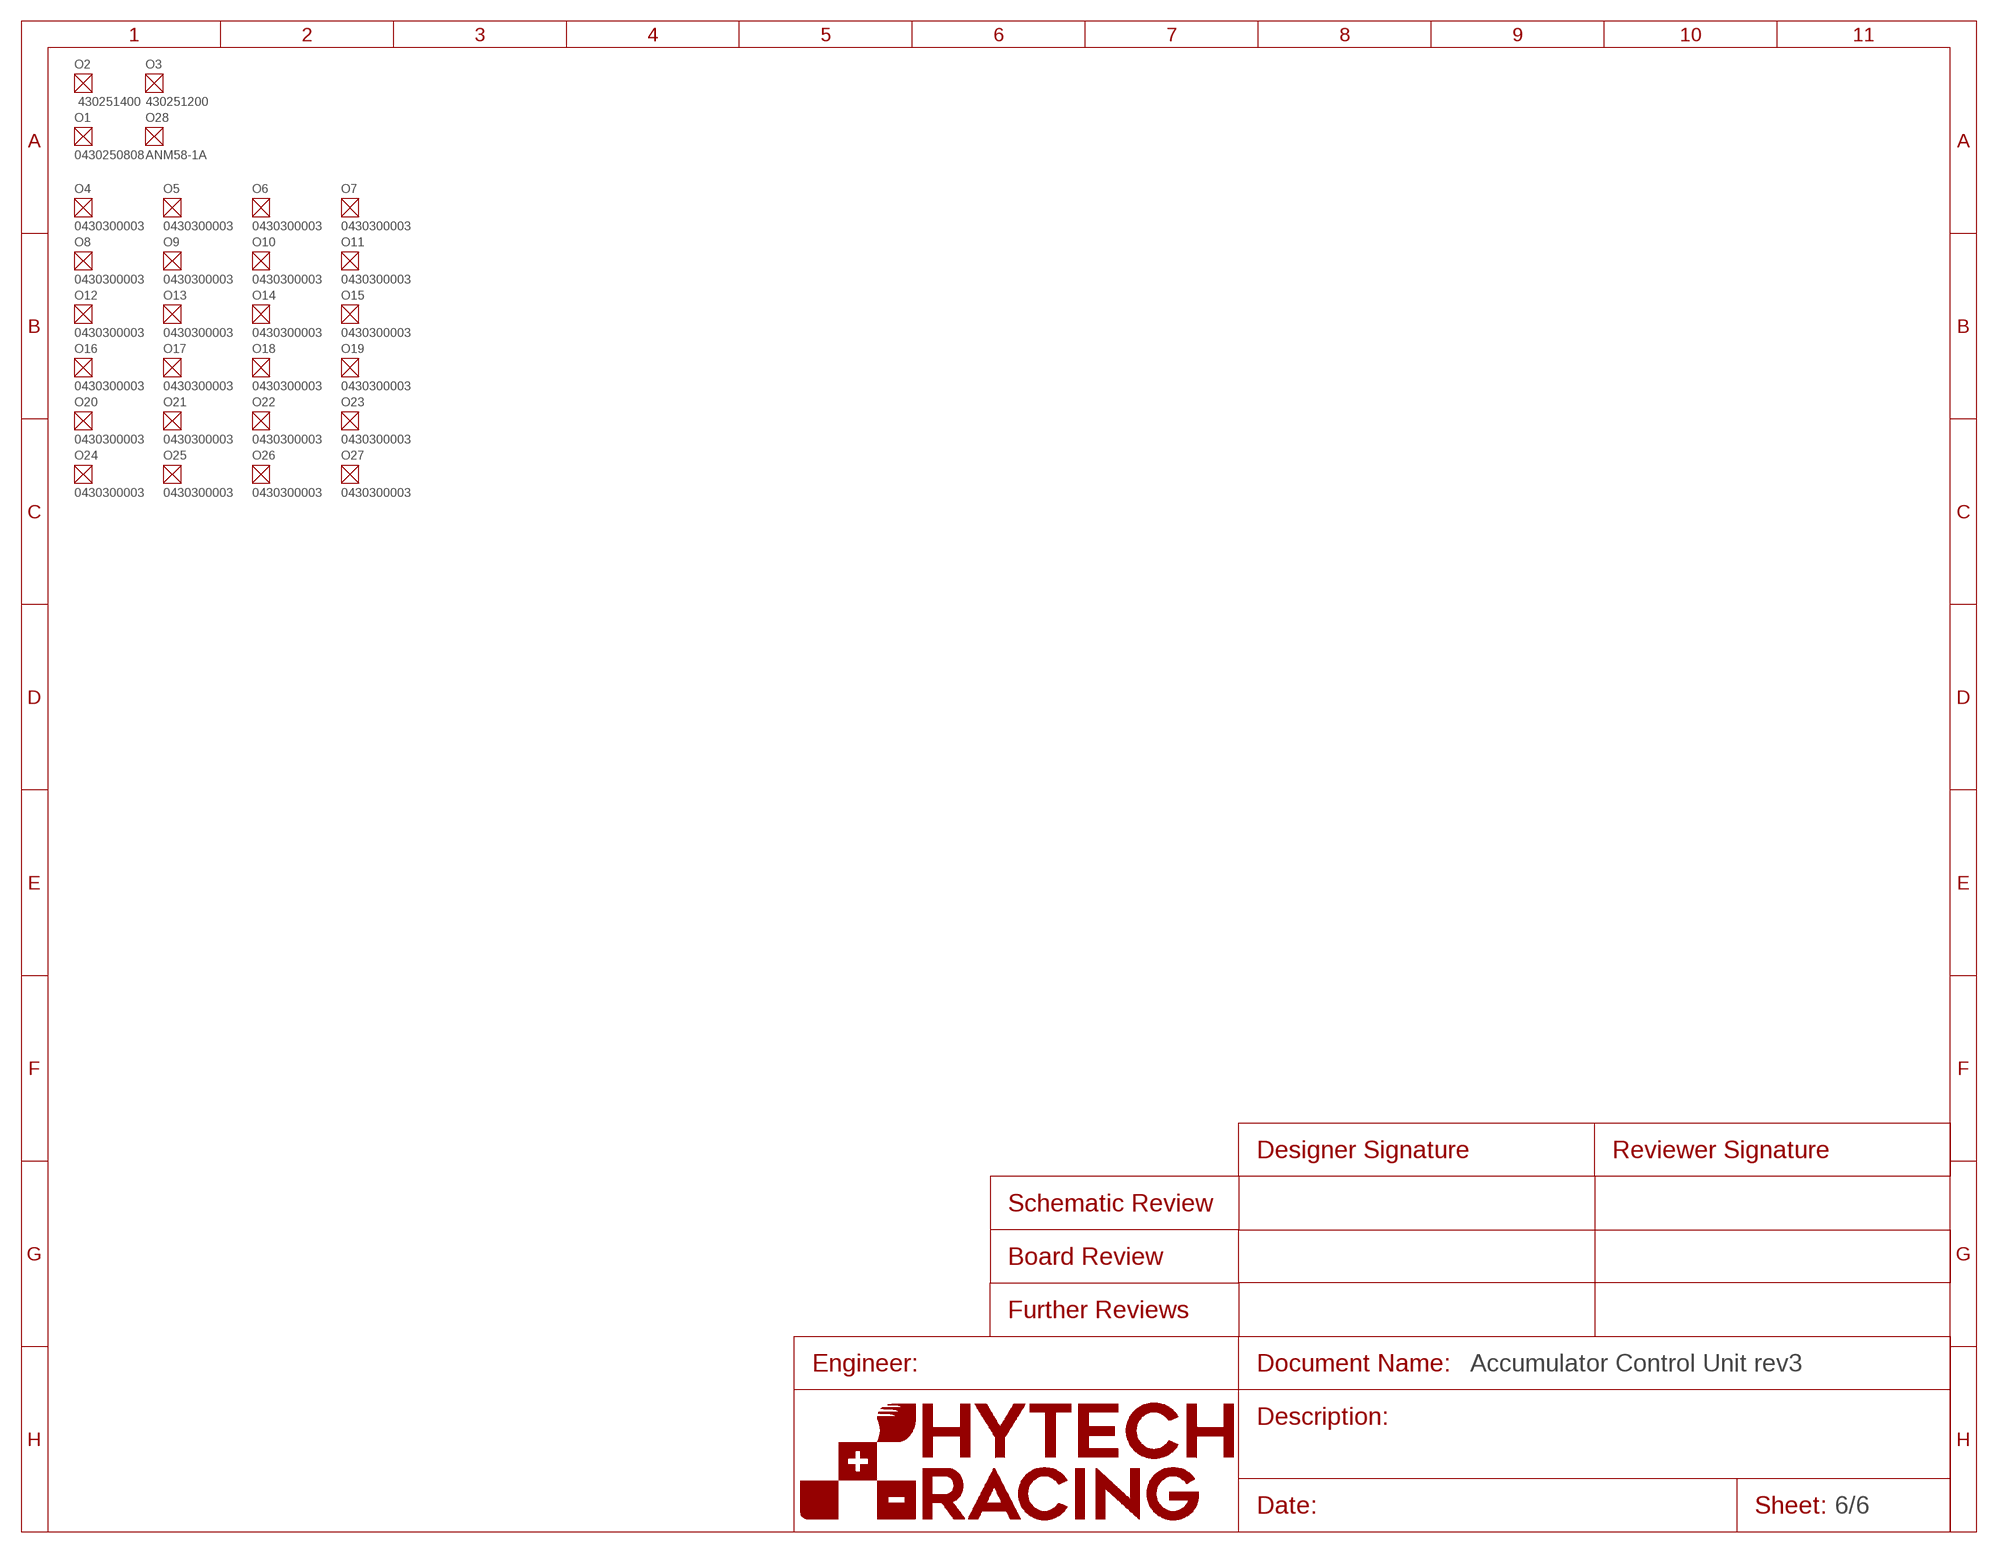
[diagram p5: schematic, sheet 6]
O1 (RECEPTACLE-8_MICROFIT): DKPN: WM13210-ND; MANUFACTURER: Molex; MOPN: 538-43025-0808; MPN: 0430250808
O2 (RECEPTACLE-14_MICROFIT): DKPN: 0430251400; MANUFACTURER: Molex; MOPN: 538-43025-1400; MPN: 430251400
O3 (RECEPTACLE-12_MICROFIT): DKPN: WM1788-ND; MANUFACTURER: Molex; MOPN: 538-43025-1200; MPN: 430251200
O4 (CRIMP_MICROFIT_20-24): DKPN: WM2776CT-ND; GAUGE: 20-24; MANUFACTURER: Molex; MOPN: 538-43030-0003; MPN: 0430300003
O5 (CRIMP_MICROFIT_20-24): DKPN: WM2776CT-ND; GAUGE: 20-24; MANUFACTURER: Molex; MOPN: 538-43030-0003; MPN: 0430300003
O6 (CRIMP_MICROFIT_20-24): DKPN: WM2776CT-ND; GAUGE: 20-24; MANUFACTURER: Molex; MOPN: 538-43030-0003; MPN: 0430300003
O7 (CRIMP_MICROFIT_20-24): DKPN: WM2776CT-ND; GAUGE: 20-24; MANUFACTURER: Molex; MOPN: 538-43030-0003; MPN: 0430300003
O8 (CRIMP_MICROFIT_20-24): DKPN: WM2776CT-ND; GAUGE: 20-24; MANUFACTURER: Molex; MOPN: 538-43030-0003; MPN: 0430300003
O9 (CRIMP_MICROFIT_20-24): DKPN: WM2776CT-ND; GAUGE: 20-24; MANUFACTURER: Molex; MOPN: 538-43030-0003; MPN: 0430300003
O10 (CRIMP_MICROFIT_20-24): DKPN: WM2776CT-ND; GAUGE: 20-24; MANUFACTURER: Molex; MOPN: 538-43030-0003; MPN: 0430300003
O11 (CRIMP_MICROFIT_20-24): DKPN: WM2776CT-ND; GAUGE: 20-24; MANUFACTURER: Molex; MOPN: 538-43030-0003; MPN: 0430300003
O12 (CRIMP_MICROFIT_20-24): DKPN: WM2776CT-ND; GAUGE: 20-24; MANUFACTURER: Molex; MOPN: 538-43030-0003; MPN: 0430300003
O13 (CRIMP_MICROFIT_20-24): DKPN: WM2776CT-ND; GAUGE: 20-24; MANUFACTURER: Molex; MOPN: 538-43030-0003; MPN: 0430300003
O14 (CRIMP_MICROFIT_20-24): DKPN: WM2776CT-ND; GAUGE: 20-24; MANUFACTURER: Molex; MOPN: 538-43030-0003; MPN: 0430300003
O15 (CRIMP_MICROFIT_20-24): DKPN: WM2776CT-ND; GAUGE: 20-24; MANUFACTURER: Molex; MOPN: 538-43030-0003; MPN: 0430300003
O16 (CRIMP_MICROFIT_20-24): DKPN: WM2776CT-ND; GAUGE: 20-24; MANUFACTURER: Molex; MOPN: 538-43030-0003; MPN: 0430300003
O17 (CRIMP_MICROFIT_20-24): DKPN: WM2776CT-ND; GAUGE: 20-24; MANUFACTURER: Molex; MOPN: 538-43030-0003; MPN: 0430300003
O18 (CRIMP_MICROFIT_20-24): DKPN: WM2776CT-ND; GAUGE: 20-24; MANUFACTURER: Molex; MOPN: 538-43030-0003; MPN: 0430300003
O19 (CRIMP_MICROFIT_20-24): DKPN: WM2776CT-ND; GAUGE: 20-24; MANUFACTURER: Molex; MOPN: 538-43030-0003; MPN: 0430300003
O20 (CRIMP_MICROFIT_20-24): DKPN: WM2776CT-ND; GAUGE: 20-24; MANUFACTURER: Molex; MOPN: 538-43030-0003; MPN: 0430300003
O21 (CRIMP_MICROFIT_20-24): DKPN: WM2776CT-ND; GAUGE: 20-24; MANUFACTURER: Molex; MOPN: 538-43030-0003; MPN: 0430300003
O22 (CRIMP_MICROFIT_20-24): DKPN: WM2776CT-ND; GAUGE: 20-24; MANUFACTURER: Molex; MOPN: 538-43030-0003; MPN: 0430300003
O23 (CRIMP_MICROFIT_20-24): DKPN: WM2776CT-ND; GAUGE: 20-24; MANUFACTURER: Molex; MOPN: 538-43030-0003; MPN: 0430300003
O24 (CRIMP_MICROFIT_20-24): DKPN: WM2776CT-ND; GAUGE: 20-24; MANUFACTURER: Molex; MOPN: 538-43030-0003; MPN: 0430300003
O25 (CRIMP_MICROFIT_20-24): DKPN: WM2776CT-ND; GAUGE: 20-24; MANUFACTURER: Molex; MOPN: 538-43030-0003; MPN: 0430300003
O26 (CRIMP_MICROFIT_20-24): DKPN: WM2776CT-ND; GAUGE: 20-24; MANUFACTURER: Molex; MOPN: 538-43030-0003; MPN: 0430300003
O27 (CRIMP_MICROFIT_20-24): DKPN: WM2776CT-ND; GAUGE: 20-24; MANUFACTURER: Molex; MOPN: 538-43030-0003; MPN: 0430300003
O28 (FUSE_MINI_BLADE_1): DKPN: 2298-ANM58-1A-ND; MANUFACTURER: OptiFuse; MPN: ANM58-1A

## Library data of the parts
3.3V AMS_OK = HyTechDevices - Copy:LED_?_*: LED; COLOR: Green; DKPN: 754-1790-1-ND; MANUFACTURER: Kingbright; MOPN: 604-APT1608ZGCK; MPN: APT1608ZGCK
5V = HyTechDevices - Copy:LED_?_*: LED; COLOR: Blue; DKPN: 754-1789-1-ND; MANUFACTURER: Kingbright; MOPN: 604-APT1608VBC/D; MPN: APT1608VBC/D
12V = HyTechDevices - Copy:LED_?_*: LED; COLOR: Red; DKPN: 754-1786-1-ND; MANUFACTURER: Kingbright; MOPN: 604-APT1608SECKJ3PRV; MPN: APT1608SECK/J3-PRV
A1 = HyTechDevices - Copy:VOLTAGE_REGULATOR_MODULE_?_*: Voltage Regulator Modules OKI-78SR Datasheet <https://www.mouser.com/datasheet/2/281/oki-78sr-56393.pdf>; DKPN: 811-2196-5-ND; MANUFACTURER: Murata Power Solutions Inc.; MOPN: 580-OKI78SR5/1.5W36C; MPN: OKI-78SR-5/1.5-W36-C
A2 = HyTechDevices:TEENSY_4.0: Teensy 4.0 Datasheet <https://www.pjrc.com/store/teensy40.html> Requires ordering of: 2: 14 pin, 0.1" pitch female headers; TEENSY: 4.0
BSPD_CURRENT CURRENT_REF CURRENT_SENSE PACK+_OUT_TEST PRECHARGE_OK_TEST TD+ TD- TP_AMS_OK TP_IMD_OK TS+_OUT_TEST WATCHDOG_OK = HyTechDevices - Copy:TEST_POINT: Test Point; DKPN: 36-5015CT-ND; MANUFACTURER: Keystone Electronics; MOPN: 534-5015; MPN: 5015
C1 C100 = HyTechDevices - Copy:CAPACITOR_?_*: Capacitor, Non-Polarized; CAPACITANCE: 10nF; DKPN: 311-4054-1-ND; MANUFACTURER: Yageo; MOPN: 603-CC603KRX7R6BB103; MPN: CC0603KRX7R6BB103; TOLERANCE: 10%; VOLTAGE: 10V
C2 C8 C20 C29 C35 = HyTechDevices:CAPACITOR_?_*: Capacitor, Non-Polarized; CAPACITANCE: 0.1µF; DKPN: 1276-1006-1-ND; MANUFACTURER: Samsung Electro-Mechanics; MOPN: 187-CL10B104KA8NNNC; MPN: CL10B104KA8NNNC; TOLERANCE: 10%; VOLTAGE: 25V
C3 C9-C11 C21 C22 C30 C31 = HyTechDevices - Copy:CAPACITOR_?_*: Capacitor, Non-Polarized; CAPACITANCE: 0.1µF; DKPN: 720-1688-1-ND; MANUFACTURER: Vishay Vitramon; MOPN: 77-VJ0603Y104JXQPBC; MPN: VJ0603Y104JXQPW1BC; TOLERANCE: 5%; VOLTAGE: 10V
C4 C12 C23 C32 = HyTechDevices - Copy:CAPACITOR_?_*: Capacitor, Non-Polarized; CAPACITANCE: 680pF; DKPN: 732-7757-1-ND; MANUFACTURER: Würth Elektronik; MOPN: 710-885012006013; MPN: 885012006013; TOLERANCE: 5%; VOLTAGE: 10V
C5 C13-C19 C26-C28 C34 C38 = HyTechDevices:CAPACITOR_?_*: Capacitor, Non-Polarized; CAPACITANCE: 0.1µF; DKPN: 720-1688-1-ND; MANUFACTURER: Vishay Vitramon; MOPN: 77-VJ0603Y104JXQPBC; MPN: VJ0603Y104JXQPW1BC; TOLERANCE: 5%; VOLTAGE: 10V
C6 = HyTechDevices:CAPACITOR_?_*: Capacitor, Non-Polarized; CAPACITANCE: 10nF; DKPN: 311-4054-1-ND; MANUFACTURER: Yageo; MOPN: 603-CC603KRX7R6BB103; MPN: CC0603KRX7R6BB103; TOLERANCE: 10%; VOLTAGE: 10V
C24 C33 = HyTechDevices:CAPACITOR_?_*: Capacitor, Non-Polarized; CAPACITANCE: 10µF; DKPN: 490-7202-1-ND; MANUFACTURER: Murata Electronics; MOPN: 81-GRM188R61E106MA3D; MPN: GRM188R61E106MA73D; TOLERANCE: 20%; VOLTAGE: 25V
C25 = HyTechDevices:CAPACITOR_?_*: Capacitor, Non-Polarized; CAPACITANCE: 4.7nF; DKPN: 732-7931-1-ND; MANUFACTURER: Würth Elektronik; MOPN: 710-885012206012; MPN: 885012206012; TOLERANCE: 10%; VOLTAGE: 10V
C36 C103 = HyTechDevices - Copy:CAPACITOR_?_*: Capacitor, Non-Polarized; CAPACITANCE: 4.7µF; DKPN: 1276-1044-1-ND; MANUFACTURER: Samsung Electro-Mechanics; MOPN: 187-CL10A475KP8NNNC; MPN: CL10A475KP8NNNC; TOLERANCE: 10%; VOLTAGE: 10V
C37 = HyTechDevices - Copy:CAPACITOR_?_*: Capacitor, Non-Polarized; CAPACITANCE: 1µF; DKPN: 311-1796-1-ND; MANUFACTURER: Yageo; MOPN: 603-CC603KRX7R6BB105; MPN: CC0603KRX7R6BB105; TOLERANCE: 10%; VOLTAGE: 10V
C39 = HyTechDevices:CAPACITOR_?_*: Capacitor, Non-Polarized; CAPACITANCE: 1µF; DKPN: 311-1796-1-ND; MANUFACTURER: Yageo; MOPN: 603-CC603KRX7R6BB105; MPN: CC0603KRX7R6BB105; TOLERANCE: 10%; VOLTAGE: 10V
C101 = HyTechDevices - Copy:CAPACITOR_?_*: Capacitor, Non-Polarized; CAPACITANCE: 1µF; DKPN: 1276-1184-1-ND; MANUFACTURER: Samsung Electro-Mechanics; MOPN: 187-CL10B105KA8NNNC; MPN: CL10B105KA8NNNC; TOLERANCE: 10%; VOLTAGE: 25V
C102 = HyTechDevices - Copy:CAPACITOR_?_*: Capacitor, Non-Polarized; CAPACITANCE: 0.1µF; DKPN: 1276-1006-1-ND; MANUFACTURER: Samsung Electro-Mechanics; MOPN: 187-CL10B104KA8NNNC; MPN: CL10B104KA8NNNC; TOLERANCE: 10%; VOLTAGE: 25V
C104 = HyTechDevices:CAPACITOR_?_*: Capacitor, Non-Polarized; CAPACITANCE: 1µF; DKPN: 1276-1184-1-ND; MANUFACTURER: Samsung Electro-Mechanics; MOPN: 187-CL10B105KA8NNNC; MPN: CL10B105KA8NNNC; TOLERANCE: 10%; VOLTAGE: 25V
D2 D4 = HyTechDevices - Copy:TVS_*: TVS Diode GSOT Datasheet <https://www.mouser.com/datasheet/2/427/gsot03-1767593.pdf>; DKPN: GSOT08-E3-08-ND; MANUFACTURER: Vishay General Semiconductor - Diodes Division; MOPN: 78-GSOT08-E3-08; MPN: GSOT08-E3-08; VOLTAGE: 8V
D3 D7-D11 D100 D101 = HyTechDevices:TVS_*: TVS Diode GSOT Datasheet <https://www.mouser.com/datasheet/2/427/gsot03-1767593.pdf>; DKPN: GSOT15-E3-08CT-ND; MANUFACTURER: Vishay General Semiconductor - Diodes Division; MOPN: 78-GSOT15-E3-08; MPN: GSOT15-E3-08; VOLTAGE: 15V
F1 F2 = HyTechDevices:FUSE_?_*: Fuse 885 Series <https://www.mouser.com/datasheet/2/240/Littelfuse_Fuse_885_Datasheet_pdf-1371443.pdf> MST 250 Series <https://www.mouser.com/datasheet/2/358/typ_MST_250-1772502.pdf> OMF 125 Series <https://www.mouser.com/datasheet/2/358/typ_OMF_125-1275954.pdf> 0686F0750-01 <https://www.mouser.com/datasheet/2/643/ds-CP-c2f-series-1291054.pdf>; CURRENT: 0.75A; DKPN: 507-2159-2-ND; MANUFACTURER: Bel Fuse; MOPN: 530-0686F0750-01; MPN: 0686F0750-01; VOLTAGE: 63V
IMD_OK = HyTechDevices - Copy:LED_?_*: LED; COLOR: Orange; DKPN: 754-1120-1-ND; MANUFACTURER: Kingbright; MOPN: 604-APT1608SECK; MPN: APT1608SECK
J1 = HyTechDevices - Copy:CONNECTOR-2_?_*: 2 Pin Connector; MANUFACTURER: MOLEX; MPN: 436500217
J2 = HyTechDevices - Copy:CONNECTOR-8_?_*: 8 Pin Connector; MANUFACTURER: MOLEX; MPN: 430450814
J3 = HyTechDevices - Copy:CONNECTOR-14_?_*: 14 pin connector; MANUFACTURER: MOLEX; MPN: 430451414
J4 = HyTechDevices:JUMPER_?_*: 2 Pin Connector; DKPN: S1011EC-02-ND; MANUFACTURER: Sullins Connector Solutions; MPN: PRPC002SAAN-RC
J5 = HyTechDevices - Copy:CONNECTOR-12_?_*: 12 pin connector; MANUFACTURER: MOLEX; MPN: 430451214
J6 = HyTechDevices:CONNECTOR-CAN_?_*: HyTech CAN Connector; DKPN: WM1832CT-ND; MANUFACTURER: Molex; MOPN: 538-43045-0411; MPN: 0430450411
J100 = HyTechDevices:CONNECTOR-8_?_*: 8 Pin Connector; DKPN: S7107-ND; MANUFACTURER: Sullins Connector Solutions; MPN: PPPC042LFBN-RC
OKHS = HyTechDevices - Copy:LED_?_*: LED; COLOR: Yellow; DKPN: 754-1788-1-ND; MANUFACTURER: Kingbright; MOPN: 604-APT1608SYCK/J3-PRV; MPN: APT1608SYCK/J3-PRV
PRECHARGE_OK TEENSY_OK TSAL_RED = HyTechDevices:LED_?_*: LED; COLOR: Red; DKPN: 754-1786-1-ND; MANUFACTURER: Kingbright; MOPN: 604-APT1608SECKJ3PRV; MPN: APT1608SECK/J3-PRV
Q1 Q2 Q100 Q101 = HyTechDevices:TRANSISTOR_N_MOS_?_*: N-MOSFET PMV15ENEA Datasheet <https://www.mouser.com/datasheet/2/916/PMV15ENEA-1604828.pdf> TK6P65W Datasheet <https://www.mouser.com/datasheet/2/408/TK6P65W_datasheet_en_20151225-1916290.pdf> SIR638ADP Datasheet <https://www.mouser.com/datasheet/2/427/sir638adp-1766131.pdf>; DKPN: 1727-8588-1-ND; MANUFACTURER: Nexperia USA Inc.; MOPN: 771-PMV15ENEAR; MPN: PMV15ENEAR
R1 = HyTechDevices:RESISTOR_?_*: Resistor PWR163 Series <https://www.mouser.com/datasheet/2/54/pwr163-777985.pdf> AC Series <https://www.mouser.com/datasheet/2/447/Yageo_PYu_AC_51_RoHS_L_7_1714230-1874691.pdf> PU Series <https://www.mouser.com/datasheet/2/447/PYu-PU_51_RoHS_L_6-1504619.pdf> ERA Series <https://www.mouser.com/datasheet/2/315/AOA0000C307-1149632.pdf> PWR263 Series <https://www.mouser.com/datasheet/2/54/pwr263s_35-778069.pdf> RC Series <https://www.mouser.com/datasheet/2/447/Yageo_03_18_2021_PYu_RC_Group_51_RoHS_L_11-2199992.pdf> ERJ PB3, PB6 Series <https://www.mouser.com/datasheet/2/315/AOA0000C328-1530132.pdf> ERJ PA2, P03, PA3, P06, P08, P14 Series <https://www.mouser.com/datasheet/2/315/AOA0000C331-1141874.pdf>; DKPN: P120DBCT-ND; MANUFACTURER: Panasonic Electronic Components; MOPN: 667-ERA-3AEB121V; MPN: ERA-3AEB121V; POWER: 0.1W; RESISTANCE: 120; TOLERANCE: 0.1%; VOLTAGE_CONTINUOUS: 3.46V; VOLTAGE_MAX: 75V
R2 R7 R32 R33 R61 R62 = HyTechDevices:RESISTOR_?_*: Resistor PWR163 Series <https://www.mouser.com/datasheet/2/54/pwr163-777985.pdf> AC Series <https://www.mouser.com/datasheet/2/447/Yageo_PYu_AC_51_RoHS_L_7_1714230-1874691.pdf> PU Series <https://www.mouser.com/datasheet/2/447/PYu-PU_51_RoHS_L_6-1504619.pdf> ERA Series <https://www.mouser.com/datasheet/2/315/AOA0000C307-1149632.pdf> PWR263 Series <https://www.mouser.com/datasheet/2/54/pwr263s_35-778069.pdf> RC Series <https://www.mouser.com/datasheet/2/447/Yageo_03_18_2021_PYu_RC_Group_51_RoHS_L_11-2199992.pdf> ERJ PB3, PB6 Series <https://www.mouser.com/datasheet/2/315/AOA0000C328-1530132.pdf> ERJ PA2, P03, PA3, P06, P08, P14 Series <https://www.mouser.com/datasheet/2/315/AOA0000C331-1141874.pdf>; DKPN: P2.0KBDCT-ND; MANUFACTURER: Panasonic Electronic Components; MOPN: 667-ERA-3ARB202V; MPN: ERA-3ARB202V; POWER: 0.1W; RESISTANCE: 2k; TOLERANCE: 0.1%; VOLTAGE_CONTINUOUS: 14.14V; VOLTAGE_MAX: 75V
R3 R9-R11 R16 R19 = HyTechDevices:RESISTOR_?_*: Resistor PWR163 Series <https://www.mouser.com/datasheet/2/54/pwr163-777985.pdf> AC Series <https://www.mouser.com/datasheet/2/447/Yageo_PYu_AC_51_RoHS_L_7_1714230-1874691.pdf> PU Series <https://www.mouser.com/datasheet/2/447/PYu-PU_51_RoHS_L_6-1504619.pdf> ERA Series <https://www.mouser.com/datasheet/2/315/AOA0000C307-1149632.pdf> PWR263 Series <https://www.mouser.com/datasheet/2/54/pwr263s_35-778069.pdf> RC Series <https://www.mouser.com/datasheet/2/447/Yageo_03_18_2021_PYu_RC_Group_51_RoHS_L_11-2199992.pdf> ERJ PB3, PB6 Series <https://www.mouser.com/datasheet/2/315/AOA0000C328-1530132.pdf> ERJ PA2, P03, PA3, P06, P08, P14 Series <https://www.mouser.com/datasheet/2/315/AOA0000C331-1141874.pdf>; DKPN: 311-1.00KHRCT-ND; MANUFACTURER: Yageo; MOPN: 603-RC0603FR-071KL; MPN: RC0603FR-071KL; POWER: 0.1W; RESISTANCE: 1k; TOLERANCE: 1%; VOLTAGE_CONTINUOUS: 10.00V; VOLTAGE_MAX: 75V
R4 R20 R79 R108 R110 = HyTechDevices:RESISTOR_?_*: Resistor PWR163 Series <https://www.mouser.com/datasheet/2/54/pwr163-777985.pdf> AC Series <https://www.mouser.com/datasheet/2/447/Yageo_PYu_AC_51_RoHS_L_7_1714230-1874691.pdf> PU Series <https://www.mouser.com/datasheet/2/447/PYu-PU_51_RoHS_L_6-1504619.pdf> ERA Series <https://www.mouser.com/datasheet/2/315/AOA0000C307-1149632.pdf> PWR263 Series <https://www.mouser.com/datasheet/2/54/pwr263s_35-778069.pdf> RC Series <https://www.mouser.com/datasheet/2/447/Yageo_03_18_2021_PYu_RC_Group_51_RoHS_L_11-2199992.pdf> ERJ PB3, PB6 Series <https://www.mouser.com/datasheet/2/315/AOA0000C328-1530132.pdf> ERJ PA2, P03, PA3, P06, P08, P14 Series <https://www.mouser.com/datasheet/2/315/AOA0000C331-1141874.pdf>; DKPN: P30KBDCT-ND; MANUFACTURER: Panasonic Electronic Components; MOPN: 667-ERA-3ARB303V; MPN: ERA-3ARB303V; POWER: 0.1W; RESISTANCE: 30k; TOLERANCE: 0.1%; VOLTAGE_CONTINUOUS: 54.77V; VOLTAGE_MAX: 75V
R5 R23 R31 R56 R78 R80 R107 = HyTechDevices - Copy:RESISTOR_?_*: Resistor PWR163 Series <https://www.mouser.com/datasheet/2/54/pwr163-777985.pdf> AC Series <https://www.mouser.com/datasheet/2/447/Yageo_PYu_AC_51_RoHS_L_7_1714230-1874691.pdf> PU Series <https://www.mouser.com/datasheet/2/447/PYu-PU_51_RoHS_L_6-1504619.pdf> ERA Series <https://www.mouser.com/datasheet/2/315/AOA0000C307-1149632.pdf> PWR263 Series <https://www.mouser.com/datasheet/2/54/pwr263s_35-778069.pdf> RC Series <https://www.mouser.com/datasheet/2/447/Yageo_03_18_2021_PYu_RC_Group_51_RoHS_L_11-2199992.pdf> ERJ PB3, PB6 Series <https://www.mouser.com/datasheet/2/315/AOA0000C328-1530132.pdf> ERJ PA2, P03, PA3, P06, P08, P14 Series <https://www.mouser.com/datasheet/2/315/AOA0000C331-1141874.pdf>; DKPN: 311-12.0KHRCT-ND; MANUFACTURER: Yageo; MOPN: 603-RC0603FR-0712KL; MPN: RC0603FR-0712KL; POWER: 0.1W; RESISTANCE: 12k; TOLERANCE: 1%; VOLTAGE_CONTINUOUS: 34.64V; VOLTAGE_MAX: 75V
R6 R12 R14 R17 R26 R27 R82 R101 R102 R106 = HyTechDevices:RESISTOR_?_*: Resistor PWR163 Series <https://www.mouser.com/datasheet/2/54/pwr163-777985.pdf> AC Series <https://www.mouser.com/datasheet/2/447/Yageo_PYu_AC_51_RoHS_L_7_1714230-1874691.pdf> PU Series <https://www.mouser.com/datasheet/2/447/PYu-PU_51_RoHS_L_6-1504619.pdf> ERA Series <https://www.mouser.com/datasheet/2/315/AOA0000C307-1149632.pdf> PWR263 Series <https://www.mouser.com/datasheet/2/54/pwr263s_35-778069.pdf> RC Series <https://www.mouser.com/datasheet/2/447/Yageo_03_18_2021_PYu_RC_Group_51_RoHS_L_11-2199992.pdf> ERJ PB3, PB6 Series <https://www.mouser.com/datasheet/2/315/AOA0000C328-1530132.pdf> ERJ PA2, P03, PA3, P06, P08, P14 Series <https://www.mouser.com/datasheet/2/315/AOA0000C331-1141874.pdf>; DKPN: 311-10.0KHRCT-ND; MANUFACTURER: Yageo; MOPN: 603-RC0603FR-0710KL; MPN: RC0603FR-0710KL; POWER: 0.1W; RESISTANCE: 10k; TOLERANCE: 1%; VOLTAGE_CONTINUOUS: 31.62V; VOLTAGE_MAX: 75V
R8 = HyTechDevices - Copy:RESISTOR_?_*: Resistor PWR163 Series <https://www.mouser.com/datasheet/2/54/pwr163-777985.pdf> AC Series <https://www.mouser.com/datasheet/2/447/Yageo_PYu_AC_51_RoHS_L_7_1714230-1874691.pdf> PU Series <https://www.mouser.com/datasheet/2/447/PYu-PU_51_RoHS_L_6-1504619.pdf> ERA Series <https://www.mouser.com/datasheet/2/315/AOA0000C307-1149632.pdf> PWR263 Series <https://www.mouser.com/datasheet/2/54/pwr263s_35-778069.pdf> RC Series <https://www.mouser.com/datasheet/2/447/Yageo_03_18_2021_PYu_RC_Group_51_RoHS_L_11-2199992.pdf> ERJ PB3, PB6 Series <https://www.mouser.com/datasheet/2/315/AOA0000C328-1530132.pdf> ERJ PA2, P03, PA3, P06, P08, P14 Series <https://www.mouser.com/datasheet/2/315/AOA0000C331-1141874.pdf>; DKPN: P2.0KBDCT-ND; MANUFACTURER: Panasonic Electronic Components; MOPN: 667-ERA-3ARB202V; MPN: ERA-3ARB202V; POWER: 0.1W; RESISTANCE: 2k; TOLERANCE: 0.1%; VOLTAGE_CONTINUOUS: 14.14V; VOLTAGE_MAX: 75V
R13 R18 R103 R104 = HyTechDevices:RESISTOR_?_*: Resistor PWR163 Series <https://www.mouser.com/datasheet/2/54/pwr163-777985.pdf> AC Series <https://www.mouser.com/datasheet/2/447/Yageo_PYu_AC_51_RoHS_L_7_1714230-1874691.pdf> PU Series <https://www.mouser.com/datasheet/2/447/PYu-PU_51_RoHS_L_6-1504619.pdf> ERA Series <https://www.mouser.com/datasheet/2/315/AOA0000C307-1149632.pdf> PWR263 Series <https://www.mouser.com/datasheet/2/54/pwr263s_35-778069.pdf> RC Series <https://www.mouser.com/datasheet/2/447/Yageo_03_18_2021_PYu_RC_Group_51_RoHS_L_11-2199992.pdf> ERJ PB3, PB6 Series <https://www.mouser.com/datasheet/2/315/AOA0000C328-1530132.pdf> ERJ PA2, P03, PA3, P06, P08, P14 Series <https://www.mouser.com/datasheet/2/315/AOA0000C331-1141874.pdf>; DKPN: 311-10.0HRCT-ND; MANUFACTURER: Yageo; MOPN: 603-RC0603FR-0710RL; MPN: RC0603FR-0710RL; POWER: 0.1W; RESISTANCE: 10; TOLERANCE: 1%; VOLTAGE_CONTINUOUS: 1V; VOLTAGE_MAX: 75V
R15 = HyTechDevices - Copy:RESISTOR_?_*: Resistor PWR163 Series <https://www.mouser.com/datasheet/2/54/pwr163-777985.pdf> AC Series <https://www.mouser.com/datasheet/2/447/Yageo_PYu_AC_51_RoHS_L_7_1714230-1874691.pdf> PU Series <https://www.mouser.com/datasheet/2/447/PYu-PU_51_RoHS_L_6-1504619.pdf> ERA Series <https://www.mouser.com/datasheet/2/315/AOA0000C307-1149632.pdf> PWR263 Series <https://www.mouser.com/datasheet/2/54/pwr263s_35-778069.pdf> RC Series <https://www.mouser.com/datasheet/2/447/Yageo_03_18_2021_PYu_RC_Group_51_RoHS_L_11-2199992.pdf> ERJ PB3, PB6 Series <https://www.mouser.com/datasheet/2/315/AOA0000C328-1530132.pdf> ERJ PA2, P03, PA3, P06, P08, P14 Series <https://www.mouser.com/datasheet/2/315/AOA0000C331-1141874.pdf>; DKPN: 13-RC0603DR-072K2LCT-ND; MANUFACTURER: Yageo; MOPN: 603-RC0603DR-072K2L; MPN: RC0603DR-072K2L; POWER: 0.1W; RESISTANCE: 2.2k; TOLERANCE: 0.5%; VOLTAGE_CONTINUOUS: 75V; VOLTAGE_MAX: 75V
R21 = HyTechDevices:RESISTOR_?_*: Resistor PWR163 Series <https://www.mouser.com/datasheet/2/54/pwr163-777985.pdf> AC Series <https://www.mouser.com/datasheet/2/447/Yageo_PYu_AC_51_RoHS_L_7_1714230-1874691.pdf> PU Series <https://www.mouser.com/datasheet/2/447/PYu-PU_51_RoHS_L_6-1504619.pdf> ERA Series <https://www.mouser.com/datasheet/2/315/AOA0000C307-1149632.pdf> PWR263 Series <https://www.mouser.com/datasheet/2/54/pwr263s_35-778069.pdf> RC Series <https://www.mouser.com/datasheet/2/447/Yageo_03_18_2021_PYu_RC_Group_51_RoHS_L_11-2199992.pdf> ERJ PB3, PB6 Series <https://www.mouser.com/datasheet/2/315/AOA0000C328-1530132.pdf> ERJ PA2, P03, PA3, P06, P08, P14 Series <https://www.mouser.com/datasheet/2/315/AOA0000C331-1141874.pdf>; DKPN: P15KBDCT-ND; MANUFACTURER: Panasonic Electronic Components; MOPN: 667-ERA-3ARB153V; MPN: ERA-3ARB153V; POWER: 0.1W; RESISTANCE: 15k; TOLERANCE: 0.1%; VOLTAGE_CONTINUOUS: 38.73V; VOLTAGE_MAX: 75V
R22 R29 R30 R37 R42-R44 R50 R52 R55 R59 R69 R71 R73 R77 R81 R100 = HyTechDevices - Copy:RESISTOR_?_*: Resistor PWR163 Series <https://www.mouser.com/datasheet/2/54/pwr163-777985.pdf> AC Series <https://www.mouser.com/datasheet/2/447/Yageo_PYu_AC_51_RoHS_L_7_1714230-1874691.pdf> PU Series <https://www.mouser.com/datasheet/2/447/PYu-PU_51_RoHS_L_6-1504619.pdf> ERA Series <https://www.mouser.com/datasheet/2/315/AOA0000C307-1149632.pdf> PWR263 Series <https://www.mouser.com/datasheet/2/54/pwr263s_35-778069.pdf> RC Series <https://www.mouser.com/datasheet/2/447/Yageo_03_18_2021_PYu_RC_Group_51_RoHS_L_11-2199992.pdf> ERJ PB3, PB6 Series <https://www.mouser.com/datasheet/2/315/AOA0000C328-1530132.pdf> ERJ PA2, P03, PA3, P06, P08, P14 Series <https://www.mouser.com/datasheet/2/315/AOA0000C331-1141874.pdf>; DKPN: 311-10.0KHRCT-ND; MANUFACTURER: Yageo; MOPN: 603-RC0603FR-0710KL; MPN: RC0603FR-0710KL; POWER: 0.1W; RESISTANCE: 10k; TOLERANCE: 1%; VOLTAGE_CONTINUOUS: 31.62V; VOLTAGE_MAX: 75V
R24 R25 R57 = HyTechDevices - Copy:RESISTOR_?_*: Resistor PWR163 Series <https://www.mouser.com/datasheet/2/54/pwr163-777985.pdf> AC Series <https://www.mouser.com/datasheet/2/447/Yageo_PYu_AC_51_RoHS_L_7_1714230-1874691.pdf> PU Series <https://www.mouser.com/datasheet/2/447/PYu-PU_51_RoHS_L_6-1504619.pdf> ERA Series <https://www.mouser.com/datasheet/2/315/AOA0000C307-1149632.pdf> PWR263 Series <https://www.mouser.com/datasheet/2/54/pwr263s_35-778069.pdf> RC Series <https://www.mouser.com/datasheet/2/447/Yageo_03_18_2021_PYu_RC_Group_51_RoHS_L_11-2199992.pdf> ERJ PB3, PB6 Series <https://www.mouser.com/datasheet/2/315/AOA0000C328-1530132.pdf> ERJ PA2, P03, PA3, P06, P08, P14 Series <https://www.mouser.com/datasheet/2/315/AOA0000C331-1141874.pdf>; DKPN: 311-1.00KHRCT-ND; MANUFACTURER: Yageo; MOPN: 603-RC0603FR-071KL; MPN: RC0603FR-071KL; POWER: 0.1W; RESISTANCE: 1k; TOLERANCE: 1%; VOLTAGE_CONTINUOUS: 10.00V; VOLTAGE_MAX: 75V
R28 = HyTechDevices:RESISTOR_?_*: Resistor PWR163 Series <https://www.mouser.com/datasheet/2/54/pwr163-777985.pdf> AC Series <https://www.mouser.com/datasheet/2/447/Yageo_PYu_AC_51_RoHS_L_7_1714230-1874691.pdf> PU Series <https://www.mouser.com/datasheet/2/447/PYu-PU_51_RoHS_L_6-1504619.pdf> ERA Series <https://www.mouser.com/datasheet/2/315/AOA0000C307-1149632.pdf> PWR263 Series <https://www.mouser.com/datasheet/2/54/pwr263s_35-778069.pdf> RC Series <https://www.mouser.com/datasheet/2/447/Yageo_03_18_2021_PYu_RC_Group_51_RoHS_L_11-2199992.pdf> ERJ PB3, PB6 Series <https://www.mouser.com/datasheet/2/315/AOA0000C328-1530132.pdf> ERJ PA2, P03, PA3, P06, P08, P14 Series <https://www.mouser.com/datasheet/2/315/AOA0000C331-1141874.pdf>; DKPN: P470BYCT-ND; MANUFACTURER: Panasonic Electronic Components; MOPN: 667-ERJ-PA3F4700V; MPN: ERJ-PA3F4700V; POWER: 0.25W; RESISTANCE: 470; TOLERANCE: 1%; VOLTAGE_CONTINUOUS: 10.84V; VOLTAGE_MAX: 150V
R34 R35 = HyTechDevices - Copy:RESISTOR_?_*: Resistor PWR163 Series <https://www.mouser.com/datasheet/2/54/pwr163-777985.pdf> AC Series <https://www.mouser.com/datasheet/2/447/Yageo_PYu_AC_51_RoHS_L_7_1714230-1874691.pdf> PU Series <https://www.mouser.com/datasheet/2/447/PYu-PU_51_RoHS_L_6-1504619.pdf> ERA Series <https://www.mouser.com/datasheet/2/315/AOA0000C307-1149632.pdf> PWR263 Series <https://www.mouser.com/datasheet/2/54/pwr263s_35-778069.pdf> RC Series <https://www.mouser.com/datasheet/2/447/Yageo_03_18_2021_PYu_RC_Group_51_RoHS_L_11-2199992.pdf> ERJ PB3, PB6 Series <https://www.mouser.com/datasheet/2/315/AOA0000C328-1530132.pdf> ERJ PA2, P03, PA3, P06, P08, P14 Series <https://www.mouser.com/datasheet/2/315/AOA0000C331-1141874.pdf>; DKPN: P470BYCT-ND; MANUFACTURER: Panasonic Electronic Components; MOPN: 667-ERJ-PA3F4700V; MPN: ERJ-PA3F4700V; POWER: 0.25W; RESISTANCE: 470; TOLERANCE: 1%; VOLTAGE_CONTINUOUS: 10.84V; VOLTAGE_MAX: 150V
R36 R60 = HyTechDevices:RESISTOR_?_*: Resistor PWR163 Series <https://www.mouser.com/datasheet/2/54/pwr163-777985.pdf> AC Series <https://www.mouser.com/datasheet/2/447/Yageo_PYu_AC_51_RoHS_L_7_1714230-1874691.pdf> PU Series <https://www.mouser.com/datasheet/2/447/PYu-PU_51_RoHS_L_6-1504619.pdf> ERA Series <https://www.mouser.com/datasheet/2/315/AOA0000C307-1149632.pdf> PWR263 Series <https://www.mouser.com/datasheet/2/54/pwr263s_35-778069.pdf> RC Series <https://www.mouser.com/datasheet/2/447/Yageo_03_18_2021_PYu_RC_Group_51_RoHS_L_11-2199992.pdf> ERJ PB3, PB6 Series <https://www.mouser.com/datasheet/2/315/AOA0000C328-1530132.pdf> ERJ PA2, P03, PA3, P06, P08, P14 Series <https://www.mouser.com/datasheet/2/315/AOA0000C331-1141874.pdf>; DKPN: 311-60.4HRCT-ND; MANUFACTURER: Yageo; MOPN: 603-RC0603FR-0760R4L; MPN: RC0603FR-0760R4L; POWER: 0.1W; RESISTANCE: 60.4; TOLERANCE: 1%; VOLTAGE_CONTINUOUS: 2.48V; VOLTAGE_MAX: 75V
R38 R51 R53 R66 R67 R74 R75 = HyTechDevices:RESISTOR_?_*: Resistor PWR163 Series <https://www.mouser.com/datasheet/2/54/pwr163-777985.pdf> AC Series <https://www.mouser.com/datasheet/2/447/Yageo_PYu_AC_51_RoHS_L_7_1714230-1874691.pdf> PU Series <https://www.mouser.com/datasheet/2/447/PYu-PU_51_RoHS_L_6-1504619.pdf> ERA Series <https://www.mouser.com/datasheet/2/315/AOA0000C307-1149632.pdf> PWR263 Series <https://www.mouser.com/datasheet/2/54/pwr263s_35-778069.pdf> RC Series <https://www.mouser.com/datasheet/2/447/Yageo_03_18_2021_PYu_RC_Group_51_RoHS_L_11-2199992.pdf> ERJ PB3, PB6 Series <https://www.mouser.com/datasheet/2/315/AOA0000C328-1530132.pdf> ERJ PA2, P03, PA3, P06, P08, P14 Series <https://www.mouser.com/datasheet/2/315/AOA0000C331-1141874.pdf>; DKPN: P11.5KDBCT-ND; MANUFACTURER: Panasonic Electronic Components; MOPN: 667-ERA-3AEB1152V; MPN: ERA-3AEB1152V; POWER: 0.1W; RESISTANCE: 11.5k; TOLERANCE: 0.1%; VOLTAGE_CONTINUOUS: 33.91V; VOLTAGE_MAX: 75V
R39 = HyTechDevices:RESISTOR_?_*: Resistor PWR163 Series <https://www.mouser.com/datasheet/2/54/pwr163-777985.pdf> AC Series <https://www.mouser.com/datasheet/2/447/Yageo_PYu_AC_51_RoHS_L_7_1714230-1874691.pdf> PU Series <https://www.mouser.com/datasheet/2/447/PYu-PU_51_RoHS_L_6-1504619.pdf> ERA Series <https://www.mouser.com/datasheet/2/315/AOA0000C307-1149632.pdf> PWR263 Series <https://www.mouser.com/datasheet/2/54/pwr263s_35-778069.pdf> RC Series <https://www.mouser.com/datasheet/2/447/Yageo_03_18_2021_PYu_RC_Group_51_RoHS_L_11-2199992.pdf> ERJ PB3, PB6 Series <https://www.mouser.com/datasheet/2/315/AOA0000C328-1530132.pdf> ERJ PA2, P03, PA3, P06, P08, P14 Series <https://www.mouser.com/datasheet/2/315/AOA0000C331-1141874.pdf>; DKPN: P84.5KDBCT-ND; MANUFACTURER: Panasonic Electronic Components; MOPN: 667-ERA-3AEB8452V; MPN: ERA-3AEB8452V; POWER: 0.1W; RESISTANCE: 84.5k; TOLERANCE: 0.1%; VOLTAGE_CONTINUOUS: 75V; VOLTAGE_MAX: 75V
R40 R45 R47 R54 R64 = HyTechDevices:RESISTOR_?_*: Resistor PWR163 Series <https://www.mouser.com/datasheet/2/54/pwr163-777985.pdf> AC Series <https://www.mouser.com/datasheet/2/447/Yageo_PYu_AC_51_RoHS_L_7_1714230-1874691.pdf> PU Series <https://www.mouser.com/datasheet/2/447/PYu-PU_51_RoHS_L_6-1504619.pdf> ERA Series <https://www.mouser.com/datasheet/2/315/AOA0000C307-1149632.pdf> PWR263 Series <https://www.mouser.com/datasheet/2/54/pwr263s_35-778069.pdf> RC Series <https://www.mouser.com/datasheet/2/447/Yageo_03_18_2021_PYu_RC_Group_51_RoHS_L_11-2199992.pdf> ERJ PB3, PB6 Series <https://www.mouser.com/datasheet/2/315/AOA0000C328-1530132.pdf> ERJ PA2, P03, PA3, P06, P08, P14 Series <https://www.mouser.com/datasheet/2/315/AOA0000C331-1141874.pdf>; RESISTANCE: DNP
R41 R48 = HyTechDevices:RESISTOR_?_*: Resistor PWR163 Series <https://www.mouser.com/datasheet/2/54/pwr163-777985.pdf> AC Series <https://www.mouser.com/datasheet/2/447/Yageo_PYu_AC_51_RoHS_L_7_1714230-1874691.pdf> PU Series <https://www.mouser.com/datasheet/2/447/PYu-PU_51_RoHS_L_6-1504619.pdf> ERA Series <https://www.mouser.com/datasheet/2/315/AOA0000C307-1149632.pdf> PWR263 Series <https://www.mouser.com/datasheet/2/54/pwr263s_35-778069.pdf> RC Series <https://www.mouser.com/datasheet/2/447/Yageo_03_18_2021_PYu_RC_Group_51_RoHS_L_11-2199992.pdf> ERJ PB3, PB6 Series <https://www.mouser.com/datasheet/2/315/AOA0000C328-1530132.pdf> ERJ PA2, P03, PA3, P06, P08, P14 Series <https://www.mouser.com/datasheet/2/315/AOA0000C331-1141874.pdf>; DKPN: P10.2KDBCT-ND; MANUFACTURER: Panasonic Electronic Components; MOPN: 667-ERA-3AEB1022V; MPN: ERA-3AEB1022V; POWER: 0.1W; RESISTANCE: 10.2k; TOLERANCE: 0.1%; VOLTAGE_CONTINUOUS: 31.94V; VOLTAGE_MAX: 75V
R46 = HyTechDevices:RESISTOR_?_*: Resistor PWR163 Series <https://www.mouser.com/datasheet/2/54/pwr163-777985.pdf> AC Series <https://www.mouser.com/datasheet/2/447/Yageo_PYu_AC_51_RoHS_L_7_1714230-1874691.pdf> PU Series <https://www.mouser.com/datasheet/2/447/PYu-PU_51_RoHS_L_6-1504619.pdf> ERA Series <https://www.mouser.com/datasheet/2/315/AOA0000C307-1149632.pdf> PWR263 Series <https://www.mouser.com/datasheet/2/54/pwr263s_35-778069.pdf> RC Series <https://www.mouser.com/datasheet/2/447/Yageo_03_18_2021_PYu_RC_Group_51_RoHS_L_11-2199992.pdf> ERJ PB3, PB6 Series <https://www.mouser.com/datasheet/2/315/AOA0000C328-1530132.pdf> ERJ PA2, P03, PA3, P06, P08, P14 Series <https://www.mouser.com/datasheet/2/315/AOA0000C331-1141874.pdf>; DKPN: P215KDBCT-ND; MANUFACTURER: Panasonic Electronic Components; MOPN: 667-ERA-3AEB2153V; MPN: ERA-3AEB2153V; POWER: 0.1W; RESISTANCE: 215k; TOLERANCE: 0.1%; VOLTAGE_CONTINUOUS: 75V; VOLTAGE_MAX: 75V
R49 R63 = HyTechDevices:RESISTOR_?_*: Resistor PWR163 Series <https://www.mouser.com/datasheet/2/54/pwr163-777985.pdf> AC Series <https://www.mouser.com/datasheet/2/447/Yageo_PYu_AC_51_RoHS_L_7_1714230-1874691.pdf> PU Series <https://www.mouser.com/datasheet/2/447/PYu-PU_51_RoHS_L_6-1504619.pdf> ERA Series <https://www.mouser.com/datasheet/2/315/AOA0000C307-1149632.pdf> PWR263 Series <https://www.mouser.com/datasheet/2/54/pwr263s_35-778069.pdf> RC Series <https://www.mouser.com/datasheet/2/447/Yageo_03_18_2021_PYu_RC_Group_51_RoHS_L_11-2199992.pdf> ERJ PB3, PB6 Series <https://www.mouser.com/datasheet/2/315/AOA0000C328-1530132.pdf> ERJ PA2, P03, PA3, P06, P08, P14 Series <https://www.mouser.com/datasheet/2/315/AOA0000C331-1141874.pdf>; DKPN: P4.12KDBCT-ND; MANUFACTURER: Panasonic Electronic Components; MOPN: 667-ERA-3AEB4121V; MPN: ERA-3AEB4121V; POWER: 0.1W; RESISTANCE: 4.12k; TOLERANCE: 0.1%; VOLTAGE_CONTINUOUS: 20.30V; VOLTAGE_MAX: 75V
R58 = HyTechDevices - Copy:RESISTOR_?_*: Resistor PWR163 Series <https://www.mouser.com/datasheet/2/54/pwr163-777985.pdf> AC Series <https://www.mouser.com/datasheet/2/447/Yageo_PYu_AC_51_RoHS_L_7_1714230-1874691.pdf> PU Series <https://www.mouser.com/datasheet/2/447/PYu-PU_51_RoHS_L_6-1504619.pdf> ERA Series <https://www.mouser.com/datasheet/2/315/AOA0000C307-1149632.pdf> PWR263 Series <https://www.mouser.com/datasheet/2/54/pwr263s_35-778069.pdf> RC Series <https://www.mouser.com/datasheet/2/447/Yageo_03_18_2021_PYu_RC_Group_51_RoHS_L_11-2199992.pdf> ERJ PB3, PB6 Series <https://www.mouser.com/datasheet/2/315/AOA0000C328-1530132.pdf> ERJ PA2, P03, PA3, P06, P08, P14 Series <https://www.mouser.com/datasheet/2/315/AOA0000C331-1141874.pdf>; DKPN: 311-2465-1-ND; MANUFACTURER: Yageo; MOPN: 603-RT0603DRE071K4L; MPN: RT0603DRE071K4L; POWER: 0.1W; RESISTANCE: 1.4K; TOLERANCE: 0.5%; VOLTAGE_CONTINUOUS: 75V; VOLTAGE_MAX: 75V
R65 R68 R72 R76 = HyTechDevices:RESISTOR_?_*: Resistor PWR163 Series <https://www.mouser.com/datasheet/2/54/pwr163-777985.pdf> AC Series <https://www.mouser.com/datasheet/2/447/Yageo_PYu_AC_51_RoHS_L_7_1714230-1874691.pdf> PU Series <https://www.mouser.com/datasheet/2/447/PYu-PU_51_RoHS_L_6-1504619.pdf> ERA Series <https://www.mouser.com/datasheet/2/315/AOA0000C307-1149632.pdf> PWR263 Series <https://www.mouser.com/datasheet/2/54/pwr263s_35-778069.pdf> RC Series <https://www.mouser.com/datasheet/2/447/Yageo_03_18_2021_PYu_RC_Group_51_RoHS_L_11-2199992.pdf> ERJ PB3, PB6 Series <https://www.mouser.com/datasheet/2/315/AOA0000C328-1530132.pdf> ERJ PA2, P03, PA3, P06, P08, P14 Series <https://www.mouser.com/datasheet/2/315/AOA0000C331-1141874.pdf>; DKPN: P10.5KDBCT-ND; MANUFACTURER: Panasonic Electronic Components; MOPN: 677-ERA-3AEB1052V; MPN: ERA-3AEB1052V; POWER: 0.1W; RESISTANCE: 10.5k; TOLERANCE: 0.1%; VOLTAGE_CONTINUOUS: 32.40V; VOLTAGE_MAX: 75V
R70 = HyTechDevices:RESISTOR_?_*: Resistor PWR163 Series <https://www.mouser.com/datasheet/2/54/pwr163-777985.pdf> AC Series <https://www.mouser.com/datasheet/2/447/Yageo_PYu_AC_51_RoHS_L_7_1714230-1874691.pdf> PU Series <https://www.mouser.com/datasheet/2/447/PYu-PU_51_RoHS_L_6-1504619.pdf> ERA Series <https://www.mouser.com/datasheet/2/315/AOA0000C307-1149632.pdf> PWR263 Series <https://www.mouser.com/datasheet/2/54/pwr263s_35-778069.pdf> RC Series <https://www.mouser.com/datasheet/2/447/Yageo_03_18_2021_PYu_RC_Group_51_RoHS_L_11-2199992.pdf> ERJ PB3, PB6 Series <https://www.mouser.com/datasheet/2/315/AOA0000C328-1530132.pdf> ERJ PA2, P03, PA3, P06, P08, P14 Series <https://www.mouser.com/datasheet/2/315/AOA0000C331-1141874.pdf>; DKPN: P11.3KDBCT-ND; MANUFACTURER: Panasonic Electronic Components; MOPN: 667-ERA-3AEB1132V; MPN: ERA-3AEB1132V; POWER: 0.1W; RESISTANCE: 11.3k; TOLERANCE: 0.1%; VOLTAGE_CONTINUOUS: 33.62V; VOLTAGE_MAX: 75V
R105 = HyTechDevices:RESISTOR_?_*: Resistor PWR163 Series <https://www.mouser.com/datasheet/2/54/pwr163-777985.pdf> AC Series <https://www.mouser.com/datasheet/2/447/Yageo_PYu_AC_51_RoHS_L_7_1714230-1874691.pdf> PU Series <https://www.mouser.com/datasheet/2/447/PYu-PU_51_RoHS_L_6-1504619.pdf> ERA Series <https://www.mouser.com/datasheet/2/315/AOA0000C307-1149632.pdf> PWR263 Series <https://www.mouser.com/datasheet/2/54/pwr263s_35-778069.pdf> RC Series <https://www.mouser.com/datasheet/2/447/Yageo_03_18_2021_PYu_RC_Group_51_RoHS_L_11-2199992.pdf> ERJ PB3, PB6 Series <https://www.mouser.com/datasheet/2/315/AOA0000C328-1530132.pdf> ERJ PA2, P03, PA3, P06, P08, P14 Series <https://www.mouser.com/datasheet/2/315/AOA0000C331-1141874.pdf>; DKPN: 311-43.0KHRCT-ND; MANUFACTURER: Yageo; MOPN: 603-RC0603FR-0743KL; MPN: RC0603FR-0743KL; POWER: 0.1W; RESISTANCE: 43k; TOLERANCE: 1%; VOLTAGE_CONTINUOUS: 65.57V; VOLTAGE_MAX: 75V
R109 = HyTechDevices:RESISTOR_?_*: Resistor PWR163 Series <https://www.mouser.com/datasheet/2/54/pwr163-777985.pdf> AC Series <https://www.mouser.com/datasheet/2/447/Yageo_PYu_AC_51_RoHS_L_7_1714230-1874691.pdf> PU Series <https://www.mouser.com/datasheet/2/447/PYu-PU_51_RoHS_L_6-1504619.pdf> ERA Series <https://www.mouser.com/datasheet/2/315/AOA0000C307-1149632.pdf> PWR263 Series <https://www.mouser.com/datasheet/2/54/pwr263s_35-778069.pdf> RC Series <https://www.mouser.com/datasheet/2/447/Yageo_03_18_2021_PYu_RC_Group_51_RoHS_L_11-2199992.pdf> ERJ PB3, PB6 Series <https://www.mouser.com/datasheet/2/315/AOA0000C328-1530132.pdf> ERJ PA2, P03, PA3, P06, P08, P14 Series <https://www.mouser.com/datasheet/2/315/AOA0000C331-1141874.pdf>; DKPN: 311-18.7KHRCT-ND; MANUFACTURER: Yageo; MOPN: 603-RC0603FR-0718K7L; MPN: RC0603FR-0718K7L; POWER: 0.1W; RESISTANCE: 18.7k; TOLERANCE: 1%; VOLTAGE_CONTINUOUS: 43.24V; VOLTAGE_MAX: 75V
T1 = HyTechDevices:TRANSFORMER: 2 Channel SMT Transformer Specs for both HM2102NL and HM2112ZNL Transformers Turns ratio: 1CT: 1CT Isolation Voltage: 4300 VDC Inductance: 150 uH Leakage Inductance: 0.50 uH max HM2102NLT: Datasheet <https://www.mouser.com/datasheet/2/336/HM2102NL-1218600.pdf> HM2112ZNLT: Datasheet <https://www.mouser.com/datasheet/2/336/HM2112ZNL-1224892.pdf>; DKPN: 1840-1036-1-ND; MANUFACTURER: Pulse Electronics; MOPN: 673-HM2112ZNLT; MPN: HM2112ZNLT
TP_3.3V = HyTechDevices - Copy:TEST_POINT: Test Point; DKPN: 36-5015CT-ND; MANUFACTURER: Keystone Electronics; MOPN: 534-5015; MPN: 5015; SIGNAL: +3V3
TP_5V = HyTechDevices - Copy:TEST_POINT: Test Point; DKPN: 36-5015CT-ND; MANUFACTURER: Keystone Electronics; MOPN: 534-5015; MPN: 5015; SIGNAL: +5V
TP_12V = HyTechDevices - Copy:TEST_POINT: Test Point; DKPN: 36-5015CT-ND; MANUFACTURER: Keystone Electronics; MOPN: 534-5015; MPN: 5015; SIGNAL: +12V
TP_GND = HyTechDevices - Copy:TEST_POINT: Test Point; DKPN: 36-5015CT-ND; MANUFACTURER: Keystone Electronics; MOPN: 534-5015; MPN: 5015; SIGNAL: GND
TP_TSAL_GREEN = HyTechDevices - Copy:TEST_POINT: Test Point; DKPN: 36-5015CT-ND; MANUFACTURER: Keystone Electronics; MOPN: 534-5015; MPN: 5015; SIGNAL: N$18
TP_TSAL_RED = HyTechDevices - Copy:TEST_POINT: Test Point; DKPN: 36-5015CT-ND; MANUFACTURER: Keystone Electronics; MOPN: 534-5015; MPN: 5015; SIGNAL: N$19
TSAL_GREEN = HyTechDevices:LED_?_*: LED; COLOR: Green; DKPN: 754-1790-1-ND; MANUFACTURER: Kingbright; MOPN: 604-APT1608ZGCK; MPN: APT1608ZGCK
U1 U2 U8 = HyTechDevices:RELAY_SOLIDSTATE_NO: AQY214EH Normally Open Solid State Relay Datasheet <https://www.datasheetq.com/datasheet-download/287654/1/Panasonic/AQY214EH>; MPN: AQY214EHA
U3 U9 U11 U13 U15 U17 U18 U20-U24 = HyTechDevices:OPAMP_1_CHANNEL_*: Op-Amp 1 Channel OPA991 Datasheet <https://www.ti.com/lit/ds/symlink/opa991.pdf?ts=1615503614502> Note: OPA991 is also a comparator; DKPN: 296-OPA991IDCKRCT-ND; MANUFACTURER: Texas Instruments; MOPN: 595-OPA991IDCKR; MPN: OPA991IDCKR
U4 U10 U19 U25 = HyTechDevices:MAX74*: 8th-Order Maxim Filter MAX7480 Datasheet <https://www.mouser.com/datasheet/2/256/MAX7480-1515905.pdf> MAX7400 Datsheet <https://www.mouser.com/datasheet/2/256/MAX7404-1514314.pdf> Recommended clock capacitor for the MAX7400/MAX7404: 885012006013 <https://www.mouser.com/datasheet/2/445/885012006013-1726946.pdf>; DKPN: MAX7404CSA+-ND; MANUFACTURER: Maxim Integrated; MOPN: 700-MAX7404CSA; MPN: MAX7404CSA+
U5 = HyTechDevices - Copy:LTC6820: LTC6820 isoSPI Isolated Communications Interface Datasheet <mouser.com/datasheet/2/609/LTC6820-1601976.pdf>; MANUFACTURER: Analog Devices; MPN: LTC6820IMS#PBF
U6 = HyTechDevices:LOGICGATE_BUFFER: Buffer SN74LVC Datasheet <https://www.ti.com/lit/ds/symlink/sn74lvc1g34.pdf>; DKPN: 296-26604-2-ND; MANUFACTURER: Texas Instruments; MOPN: 595-SN74LVC1G34DCKT; MPN: SN74LVC1G34DCKT
U7 = HyTechDevices:ADM8316; DKPN: ADM8316WBX30ARJZR7TR-ND; MANUFACTURER: Analog Devices Inc.; MOPN: 584-M8316WBX30ARJZR7; MPN: ADM8316WBX30ARJZR7
U12 U14 U16 = HyTechDevices:LOGICGATE_AND_: AND Gate SN74LVC Datasheet <https://www.ti.com/lit/ds/symlink/sn74lvc1g08.pdf>; DKPN: 296-SN74LVC1G08DCK3TR-ND; MANUFACTURER: Texas Instruments; MOPN: 595-SN74LVC1G08DCK3; MPN: SN74LVC1G08DCK3
U26 = HyTechDevices - Copy:VOLTAGE_REGULATOR_?_*: Voltage Regulators LDL1117S50R Datasheet <https://www.mouser.com/datasheet/2/389/dm00366442-1799212.pdf> NCP785AH120T1G <https://www.mouser.com/datasheet/2/308/NCP785A_D-1812704.pdf>; DKPN: 497-17239-1-ND; MANUFACTURER: STMicroelectronics; MOPN: 511-LDL1117S33R; MPN: LDL1117S33R
U27 = HyTechDevices:TCAN1051*V-Q1: TCAN1051*V Can Tranciever Datasheet <https://www.ti.com/lit/ds/symlink/tcan1051hgv-q1.pdf?HQS=dis-mous-null-mousermode-dsf-pf-null-wwe&ts=1610765132518&ref_url=https%253A%252F%252Fwww.mouser.com%252Ff>; DKPN: 296-49935-1-ND; MANUFACTURER: Texas Instruments; MOPN: 595-TCAN1051HGVDQ1; MPN: TCAN1051HGVDRQ1
U100 = HyTechDevices:ADG1423: ADG1423 Form-A/Form-C Analog Switch Datasheet <https://www.mouser.com/datasheet/2/609/ADG1421_1422_1423-1502752.pdf>; DKPN: ADG1423BRMZ-REEL7CT-ND; MANUFACTURER: Analog Devices Inc.; MOPN: 584-ADG1423BRMZ; MPN: ADG1423BRMZ
U101 = HyTechDevices:*555: **555 Precision Timer NA555, NE555, SA555, SE555 <https://www.ti.com/lit/ds/symlink/na555.pdf> LM555 <https://www.ti.com/lit/ds/symlink/lm555.pdf>; DKPN: LM555CMX/NOPBCT-ND; MANUFACTURER: Texas Instruments; MOPN: 926-LM555CMX/NOPB; MPN: LM555CMX/NOPB
WATCHDOG = HyTechDevices:LED_?_*: LED; COLOR: Blue; DKPN: 754-1789-1-ND; MANUFACTURER: Kingbright; MOPN: 604-APT1608VBC/D; MPN: APT1608VBC/D
XF1 = HyTechDevices:FUSE_HOLDER_*: Fuse Holder All PNs for the holder; if Miniblade Fuses <https://www.littelfuse.com/media?resourcetype=datasheets&itemid=0f5f58cb-559e-494b-8d53-723f30445ae5&filename=littelfuse-mini-datasheet> needed, order separately. Mini-Blade PTH <https://www.mouser.com/datasheet/2/215/3568-742601.pdf> Mini-Blade SMD <https://www.mouser.com/datasheet/2/215/588-744913.pdf>; DKPN: 36-3568-ND; MANUFACTURER: Keystone; MOPN: 534-3568; MPN: 3568